# EAGLE design dda (EAGLE 7.6.0)

## Sheet 1 of 6: Power
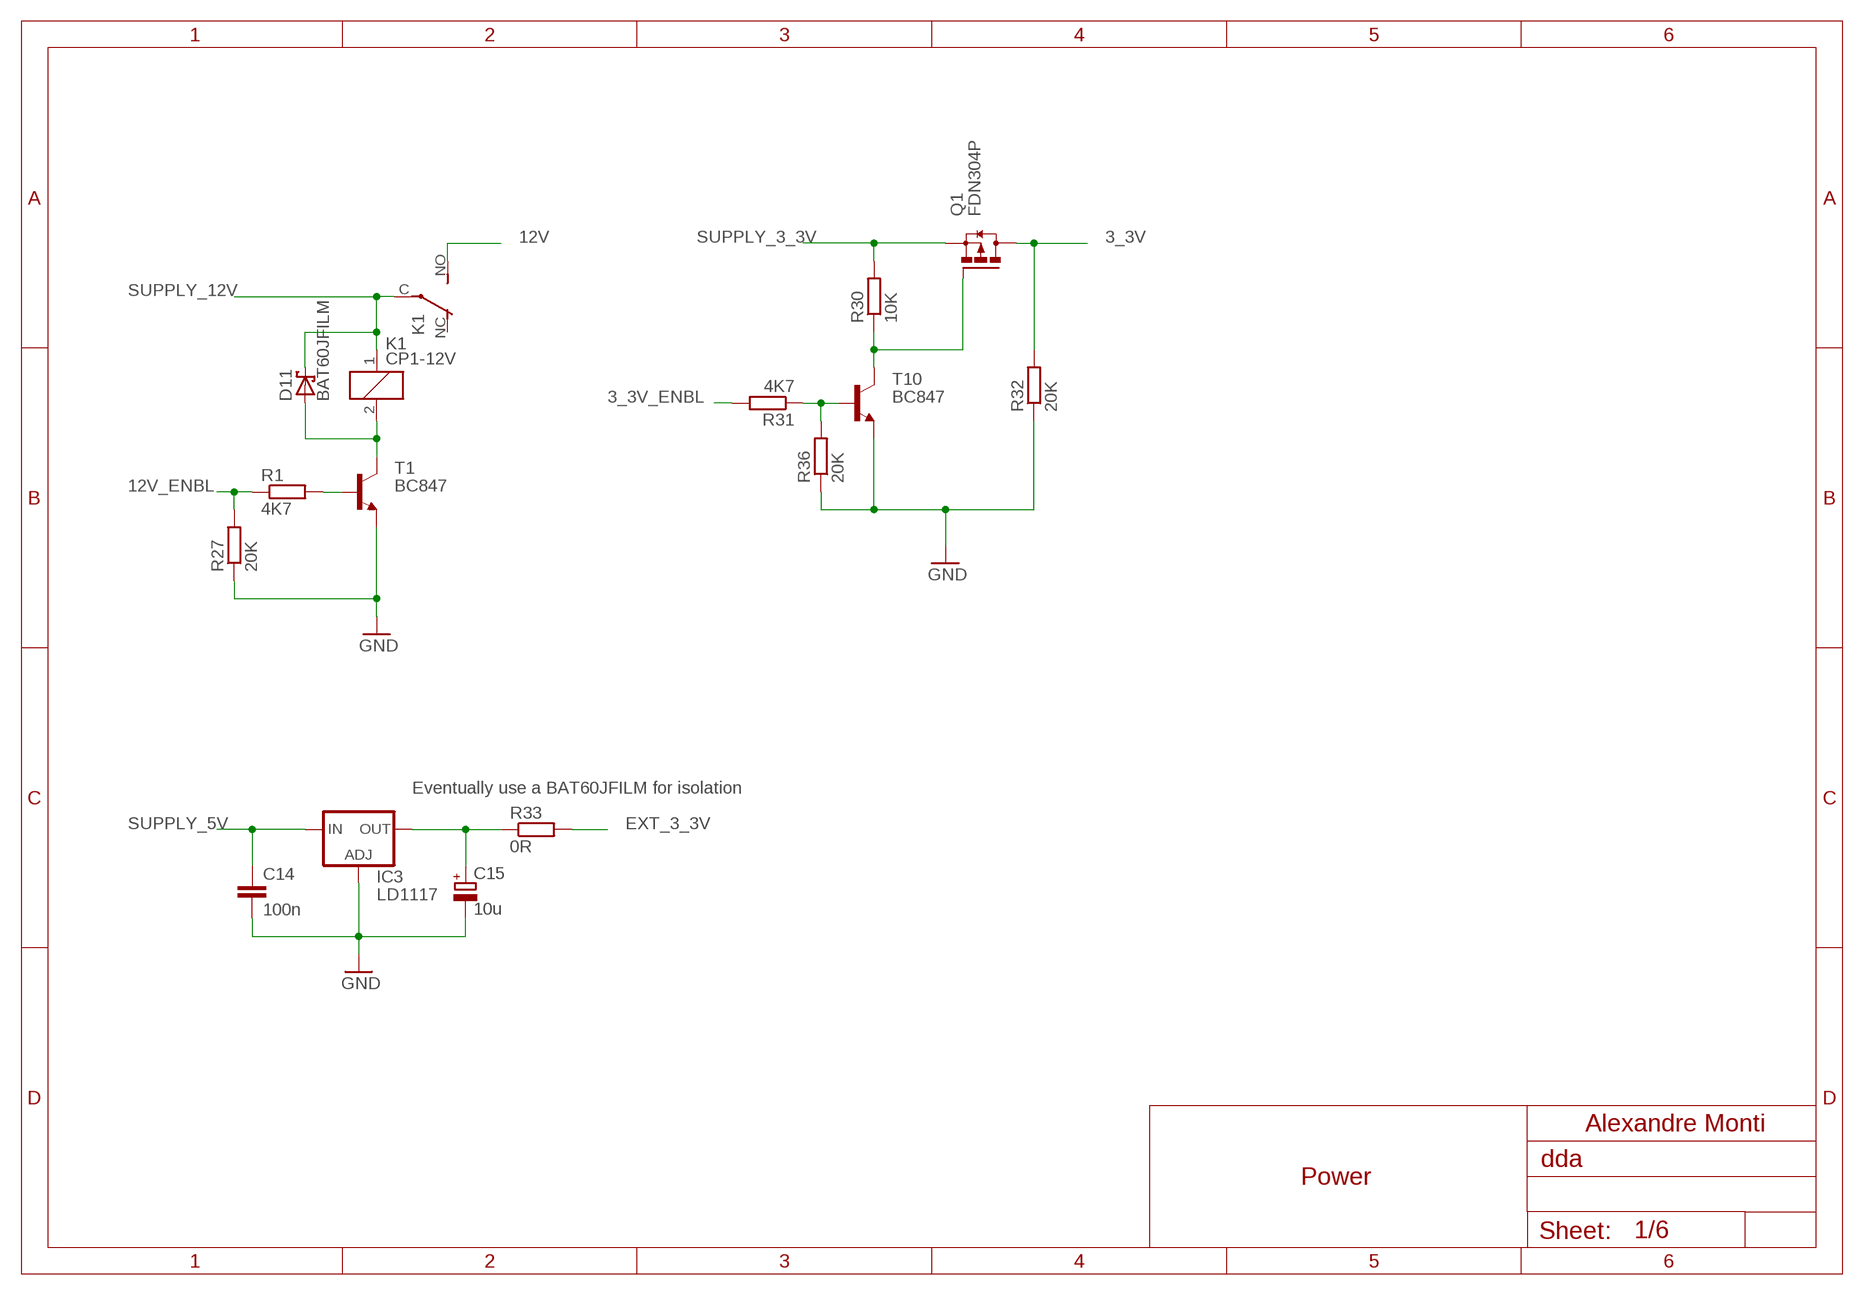
[diagram p0: schematic, sheet 1]

### Parts
C14  100n  C-EUC0805  [C0805]
C15  10u  CPOL-EUCT3216  [CT3216]
D11  BAT60JFILM  BAT60J  [SOD323_ST]
IC3  LD1117  LD117AS12TR  [SOT223]
K1  CP1-12V  [CP1]
Q1  FDN304P  FDN360P  [SUPER-SOT3]
R1  4K7  R-EU_M0805  [M0805]
R27  20K  R-EU_M0805  [M0805]
R30  10K  R-EU_M0805  [M0805]
R31  4K7  R-EU_M0805  [M0805]
R32  20K  R-EU_M0805  [M0805]
R33  0R  R-EU_R0805W  [R0805W]
R36  20K  R-EU_M0805  [M0805]
T1  BC847  [SOT23]
T10  BC847  [SOT23]

### Nets
3_3V: Q1.3(D) R32.2 ; also sheet 2,3,4,5
3_3V_ENBL: R31.2 ; also sheet 6
12V: K1.NO(2:S) ; also sheet 2,3
12V_ENBL: R1.1 R27.2 ; also sheet 5
EXT_3_3V: R33.2 ; also sheet 6
GND: C14.2 C15.- IC3.1(ADJ) R27.1 R32.1 R36.1 T1.2(E) T10.2(E) ; also sheet 2,3,4,5,6
N$1: Q1.1(G) R30.1 T10.3(C)
N$3: R31.1 R36.2 T10.1(B)
N$9: C15.+ IC3.4(OUT) R33.1
N$17: D11.A K1.2 T1.3(C)
N$18: R1.2 T1.1(B)
SUPPLY_3_3V: Q1.2(S) R30.2 ; also sheet 6
SUPPLY_5V: C14.1 IC3.3(IN) ; also sheet 6
SUPPLY_12V: D11.C K1.1 K1.C(2:P) ; also sheet 6
Unconnected: K1.NC(2:O)

### Notes on the sheet
- Eventually use a BAT60JFILM for isolation
- Alexandre Monti
- Power

## Sheet 2 of 6: LEDs
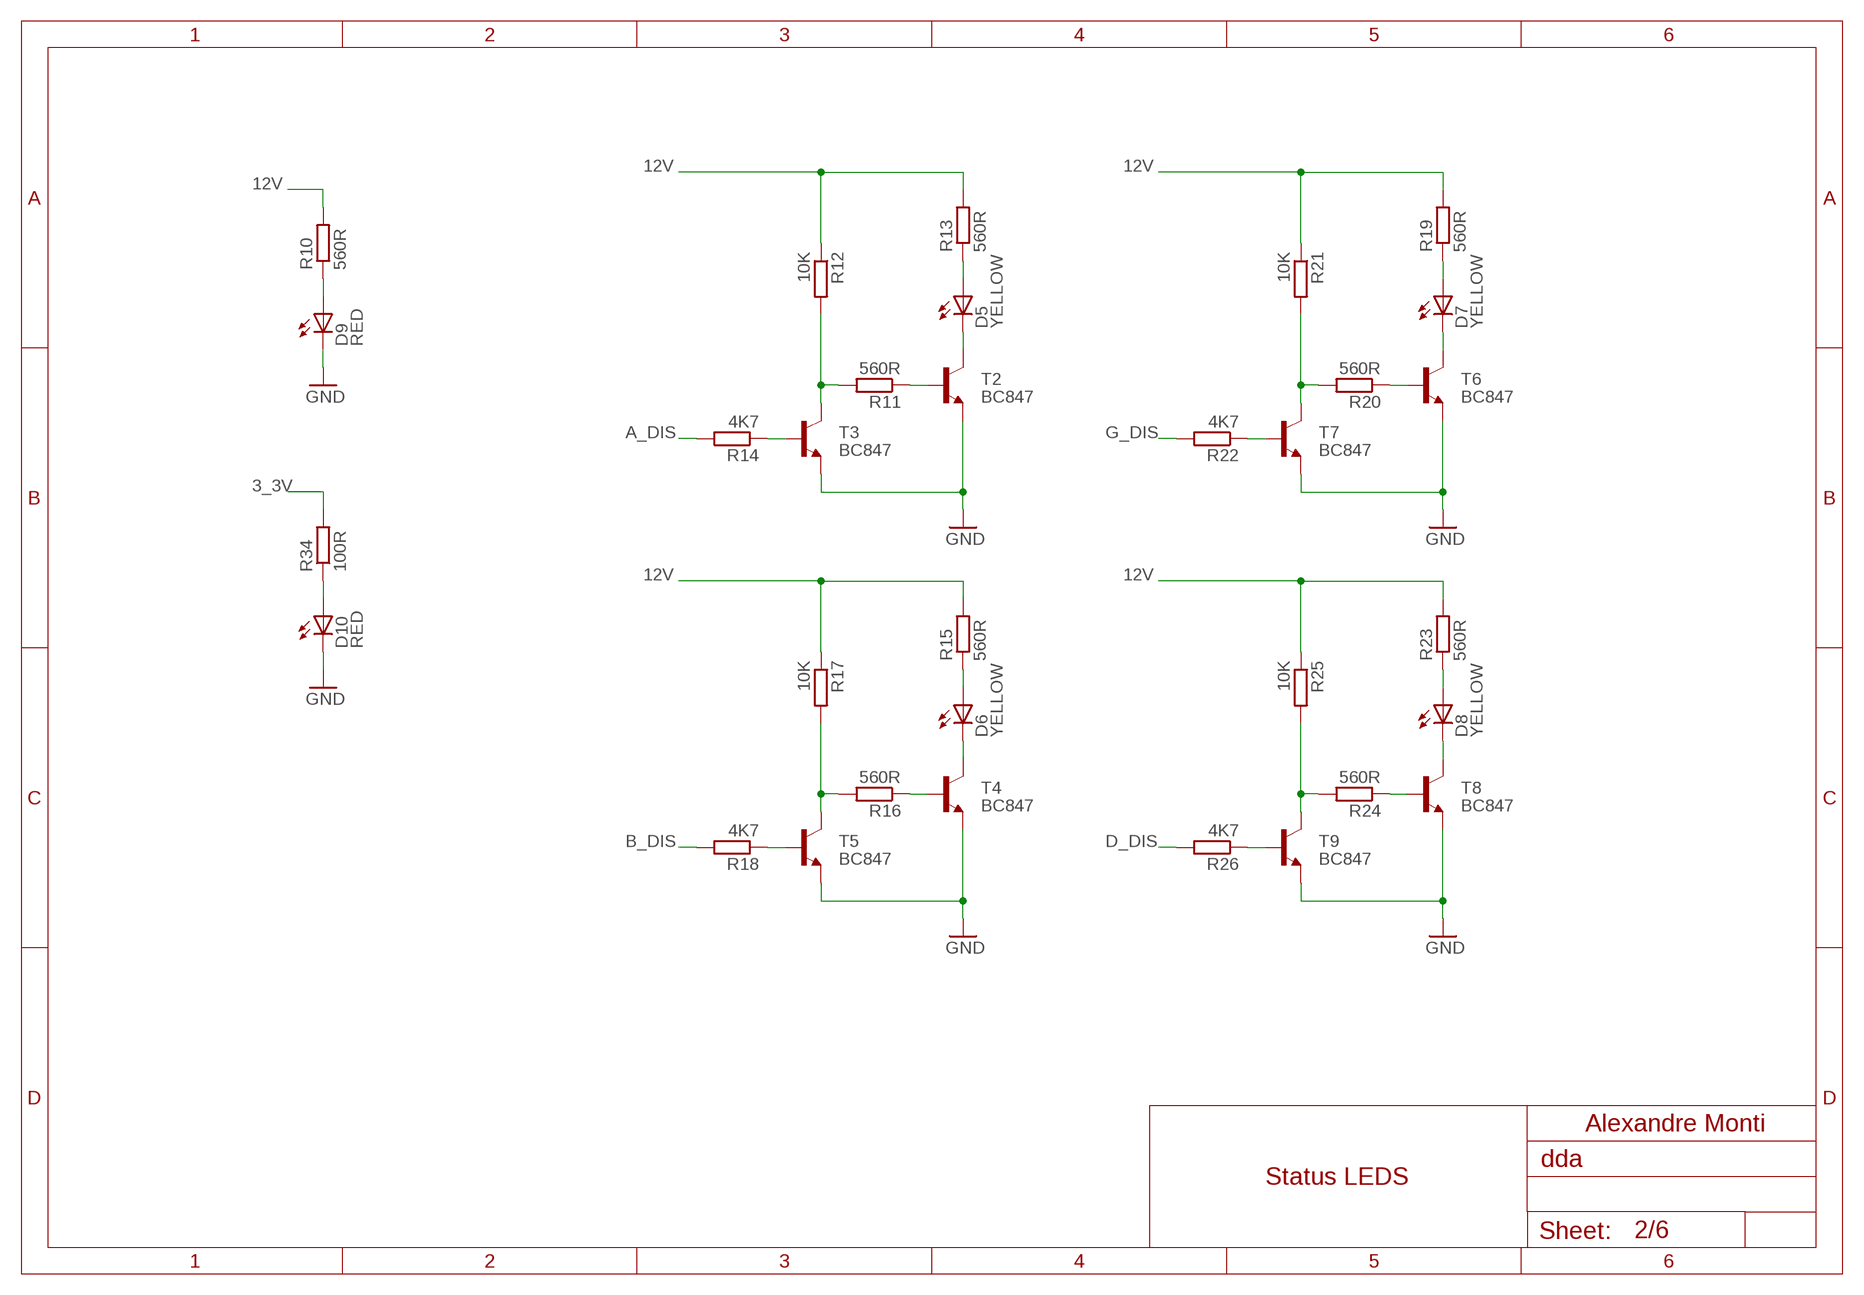
[diagram p1: schematic, sheet 2]

### Parts
D5  YELLOW  LEDCHIP-LED0805  [CHIP-LED0805]
D6  YELLOW  LEDCHIP-LED0805  [CHIP-LED0805]
D7  YELLOW  LEDCHIP-LED0805  [CHIP-LED0805]
D8  YELLOW  LEDCHIP-LED0805  [CHIP-LED0805]
D9  RED  LEDCHIP-LED0805  [CHIP-LED0805]
D10  RED  LEDCHIP-LED0805  [CHIP-LED0805]
R10  560R  R-EU_M0805  [M0805]
R11  560R  R-EU_M0805  [M0805]
R12  10K  R-EU_M0805  [M0805]
R13  560R  R-EU_M0805  [M0805]
R14  4K7  R-EU_M0805  [M0805]
R15  560R  R-EU_M0805  [M0805]
R16  560R  R-EU_M0805  [M0805]
R17  10K  R-EU_M0805  [M0805]
R18  4K7  R-EU_M0805  [M0805]
R19  560R  R-EU_M0805  [M0805]
R20  560R  R-EU_M0805  [M0805]
R21  10K  R-EU_M0805  [M0805]
R22  4K7  R-EU_M0805  [M0805]
R23  560R  R-EU_M0805  [M0805]
R24  560R  R-EU_M0805  [M0805]
R25  10K  R-EU_M0805  [M0805]
R26  4K7  R-EU_M0805  [M0805]
R34  100R  R-EU_M0805  [M0805]
T2  BC847  [SOT23]
T3  BC847  [SOT23]
T4  BC847  [SOT23]
T5  BC847  [SOT23]
T6  BC847  [SOT23]
T7  BC847  [SOT23]
T8  BC847  [SOT23]
T9  BC847  [SOT23]

### Nets
3_3V: R34.2 ; also sheet 1,3,4,5
12V: R10.2 R12.1 R13.2 R15.2 R17.1 R19.2 R21.1 R23.2 R25.1 ; also sheet 1,3
A_DIS: R14.2 ; also sheet 3,5
B_DIS: R18.2 ; also sheet 3,5
D_DIS: R26.2 ; also sheet 3,5
G_DIS: R22.2 ; also sheet 3,5
GND: D9.C D10.C T2.2(E) T3.2(E) T4.2(E) T5.2(E) T6.2(E) T7.2(E) T8.2(E) T9.2(E) ; also sheet 1,3,4,5,6
N$5: D10.A R34.1
N$28: D5.C T2.3(C)
N$29: D5.A R13.1
N$30: R11.1 T2.1(B)
N$31: R11.2 R12.2 T3.3(C)
N$32: D6.C T4.3(C)
N$33: R14.1 T3.1(B)
N$34: D6.A R15.1
N$35: R16.1 T4.1(B)
N$36: R16.2 R17.2 T5.3(C)
N$37: R18.1 T5.1(B)
N$38: D7.C T6.3(C)
N$39: D7.A R19.1
N$40: R20.1 T6.1(B)
N$41: R20.2 R21.2 T7.3(C)
N$42: R22.1 T7.1(B)
N$43: D8.C T8.3(C)
N$44: D8.A R23.1
N$45: R24.1 T8.1(B)
N$46: R24.2 R25.2 T9.3(C)
N$47: R26.1 T9.1(B)
N$885: D9.A R10.1

### Notes on the sheet
- Alexandre Monti
- Status LEDS

## Sheet 3 of 6: Steppers
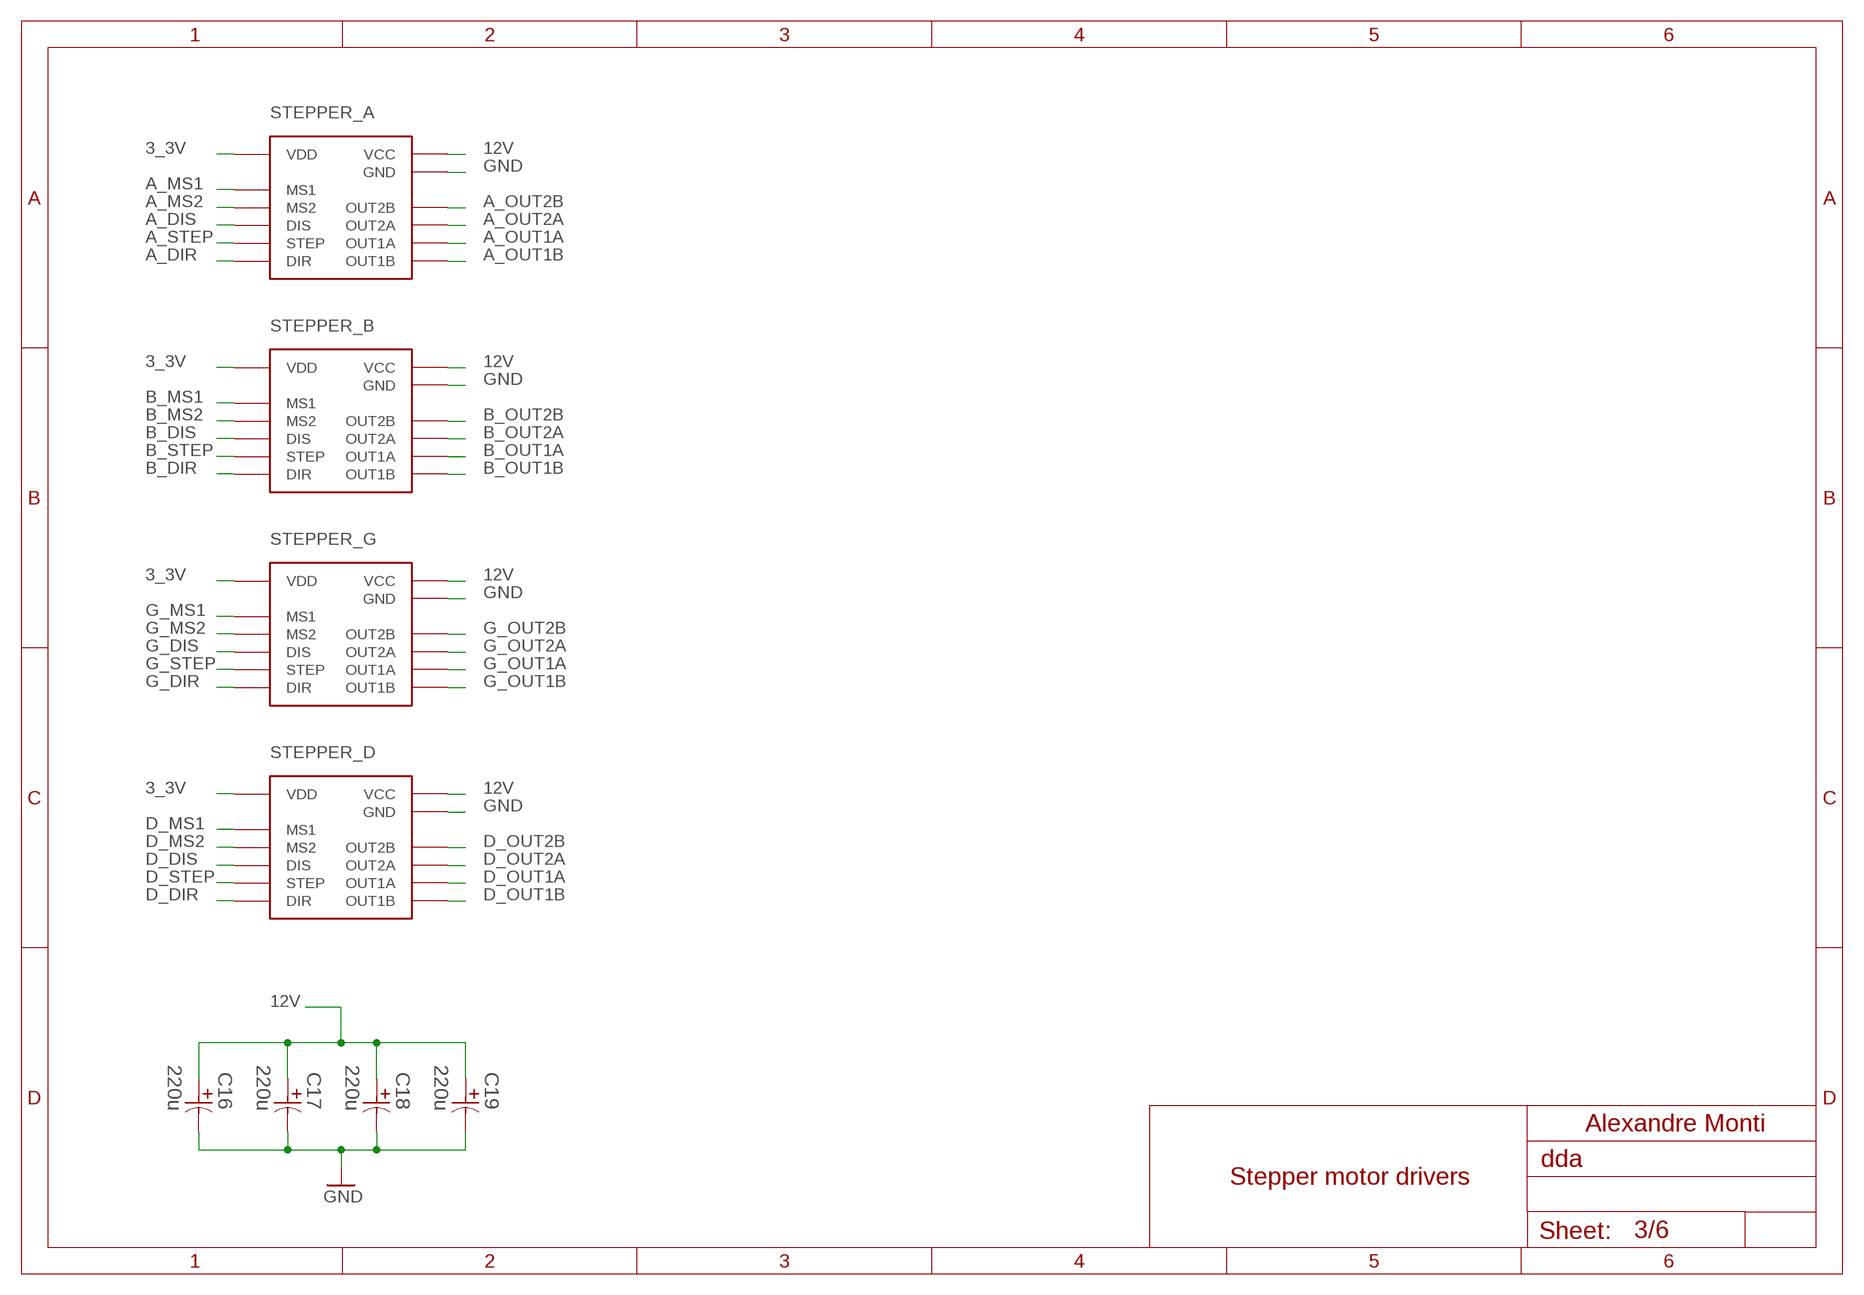
[diagram p2: schematic, sheet 3]

### Parts
C16  220u  EEE-FTE221XAP-CASE-D8  [CAPAE660X800N]
C17  220u  EEE-FTE221XAP-CASE-D8  [CAPAE660X800N]
C18  220u  EEE-FTE221XAP-CASE-D8  [CAPAE660X800N]
C19  220u  EEE-FTE221XAP-CASE-D8  [CAPAE660X800N]
STEPPER_A  REPICO_STEPPER  [REPICO_STEPPER]
STEPPER_B  REPICO_STEPPER  [REPICO_STEPPER]
STEPPER_D  REPICO_STEPPER  [REPICO_STEPPER]
STEPPER_G  REPICO_STEPPER  [REPICO_STEPPER]

### Nets
3_3V: STEPPER_A.VDD STEPPER_B.VDD STEPPER_D.VDD STEPPER_G.VDD ; also sheet 1,2,4,5
12V: C16.1 C17.1 C18.1 C19.1 STEPPER_A.VCC STEPPER_B.VCC STEPPER_D.VCC STEPPER_G.VCC ; also sheet 1,2
A_DIR: STEPPER_A.DIR ; also sheet 5
A_DIS: STEPPER_A.DIS ; also sheet 2,5
A_MS1: STEPPER_A.MS1 ; also sheet 5
A_MS2: STEPPER_A.MS2 ; also sheet 5
A_OUT1A: STEPPER_A.OUT1A ; also sheet 6
A_OUT1B: STEPPER_A.OUT1B ; also sheet 6
A_OUT2A: STEPPER_A.OUT2A ; also sheet 6
A_OUT2B: STEPPER_A.OUT2B ; also sheet 6
A_STEP: STEPPER_A.STEP ; also sheet 5
B_DIR: STEPPER_B.DIR ; also sheet 5
B_DIS: STEPPER_B.DIS ; also sheet 2,5
B_MS1: STEPPER_B.MS1 ; also sheet 5
B_MS2: STEPPER_B.MS2 ; also sheet 5
B_OUT1A: STEPPER_B.OUT1A ; also sheet 6
B_OUT1B: STEPPER_B.OUT1B ; also sheet 6
B_OUT2A: STEPPER_B.OUT2A ; also sheet 6
B_OUT2B: STEPPER_B.OUT2B ; also sheet 6
B_STEP: STEPPER_B.STEP ; also sheet 5
D_DIR: STEPPER_D.DIR ; also sheet 5
D_DIS: STEPPER_D.DIS ; also sheet 2,5
D_MS1: STEPPER_D.MS1 ; also sheet 5
D_MS2: STEPPER_D.MS2 ; also sheet 5
D_OUT1A: STEPPER_D.OUT1A ; also sheet 6
D_OUT1B: STEPPER_D.OUT1B ; also sheet 6
D_OUT2A: STEPPER_D.OUT2A ; also sheet 6
D_OUT2B: STEPPER_D.OUT2B ; also sheet 6
D_STEP: STEPPER_D.STEP ; also sheet 5
G_DIR: STEPPER_G.DIR ; also sheet 5
G_DIS: STEPPER_G.DIS ; also sheet 2,5
G_MS1: STEPPER_G.MS1 ; also sheet 5
G_MS2: STEPPER_G.MS2 ; also sheet 5
G_OUT1A: STEPPER_G.OUT1A ; also sheet 6
G_OUT1B: STEPPER_G.OUT1B ; also sheet 6
G_OUT2A: STEPPER_G.OUT2A ; also sheet 6
G_OUT2B: STEPPER_G.OUT2B ; also sheet 6
G_STEP: STEPPER_G.STEP ; also sheet 5
GND: C16.2 C17.2 C18.2 C19.2 STEPPER_A.GND STEPPER_B.GND STEPPER_D.GND STEPPER_G.GND ; also sheet 1,2,4,5,6

### Notes on the sheet
- Alexandre Monti
- Stepper motor drivers

## Sheet 4 of 6: Endstops
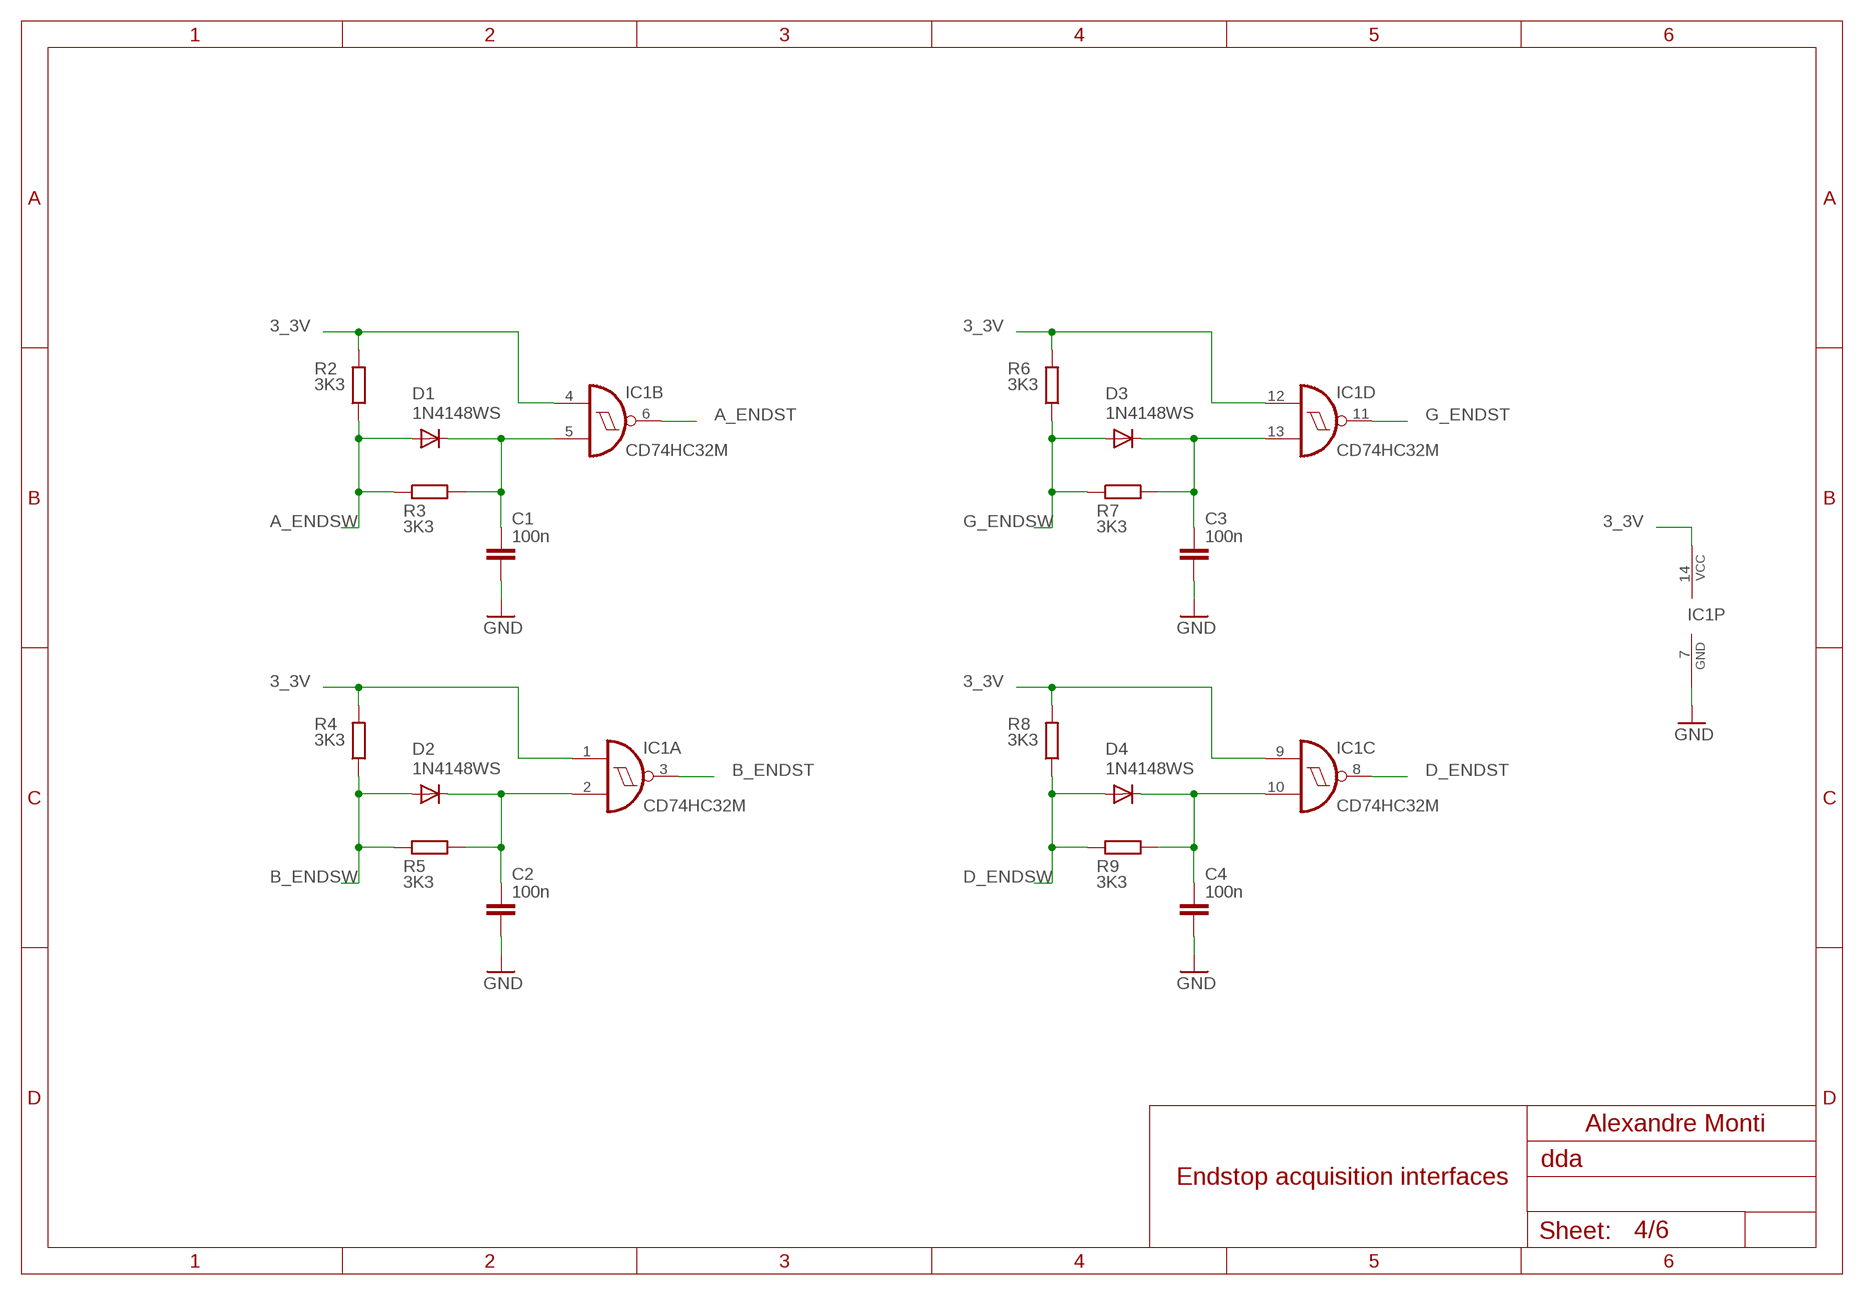
[diagram p3: schematic, sheet 4]

### Parts
C1  100n  C-EUC0805  [C0805]
C2  100n  C-EUC0805  [C0805]
C3  100n  C-EUC0805  [C0805]
C4  100n  C-EUC0805  [C0805]
D1  1N4148WS  DIODE-SOD123  [SOD123]
D2  1N4148WS  DIODE-SOD123  [SOD123]
D3  1N4148WS  DIODE-SOD123  [SOD123]
D4  1N4148WS  DIODE-SOD123  [SOD123]
IC1  CD74HC32M  74LS132D  [SO14]
R2  3K3  R-EU_M0805  [M0805]
R3  3K3  R-EU_M0805  [M0805]
R4  3K3  R-EU_M0805  [M0805]
R5  3K3  R-EU_M0805  [M0805]
R6  3K3  R-EU_M0805  [M0805]
R7  3K3  R-EU_M0805  [M0805]
R8  3K3  R-EU_M0805  [M0805]
R9  3K3  R-EU_M0805  [M0805]

### Nets
3_3V: IC1.1(A:I0) IC1.4(B:I0) IC1.9(C:I0) IC1.12(D:I0) IC1.14(P:VCC) R2.2 R4.2 R6.2 R8.2 ; also sheet 1,2,3,5
A_ENDST: IC1.6(B:O) ; also sheet 5
A_ENDSW: D1.A R2.1 R3.1 ; also sheet 6
B_ENDST: IC1.3(A:O) ; also sheet 5
B_ENDSW: D2.A R4.1 R5.1 ; also sheet 6
D_ENDST: IC1.8(C:O) ; also sheet 5
D_ENDSW: D4.A R8.1 R9.1 ; also sheet 6
G_ENDST: IC1.11(D:O) ; also sheet 5
G_ENDSW: D3.A R6.1 R7.1 ; also sheet 6
GND: C1.2 C2.2 C3.2 C4.2 IC1.7(P:GND) ; also sheet 1,2,3,5,6
N$20: C1.1 D1.C IC1.5(B:I1) R3.2
N$22: C2.1 D2.C IC1.2(A:I1) R5.2
N$24: C3.1 D3.C IC1.13(D:I1) R7.2
N$26: C4.1 D4.C IC1.10(C:I1) R9.2

### Notes on the sheet
- Alexandre Monti
- Endstop acquisition interfaces

## Sheet 5 of 6: MCU
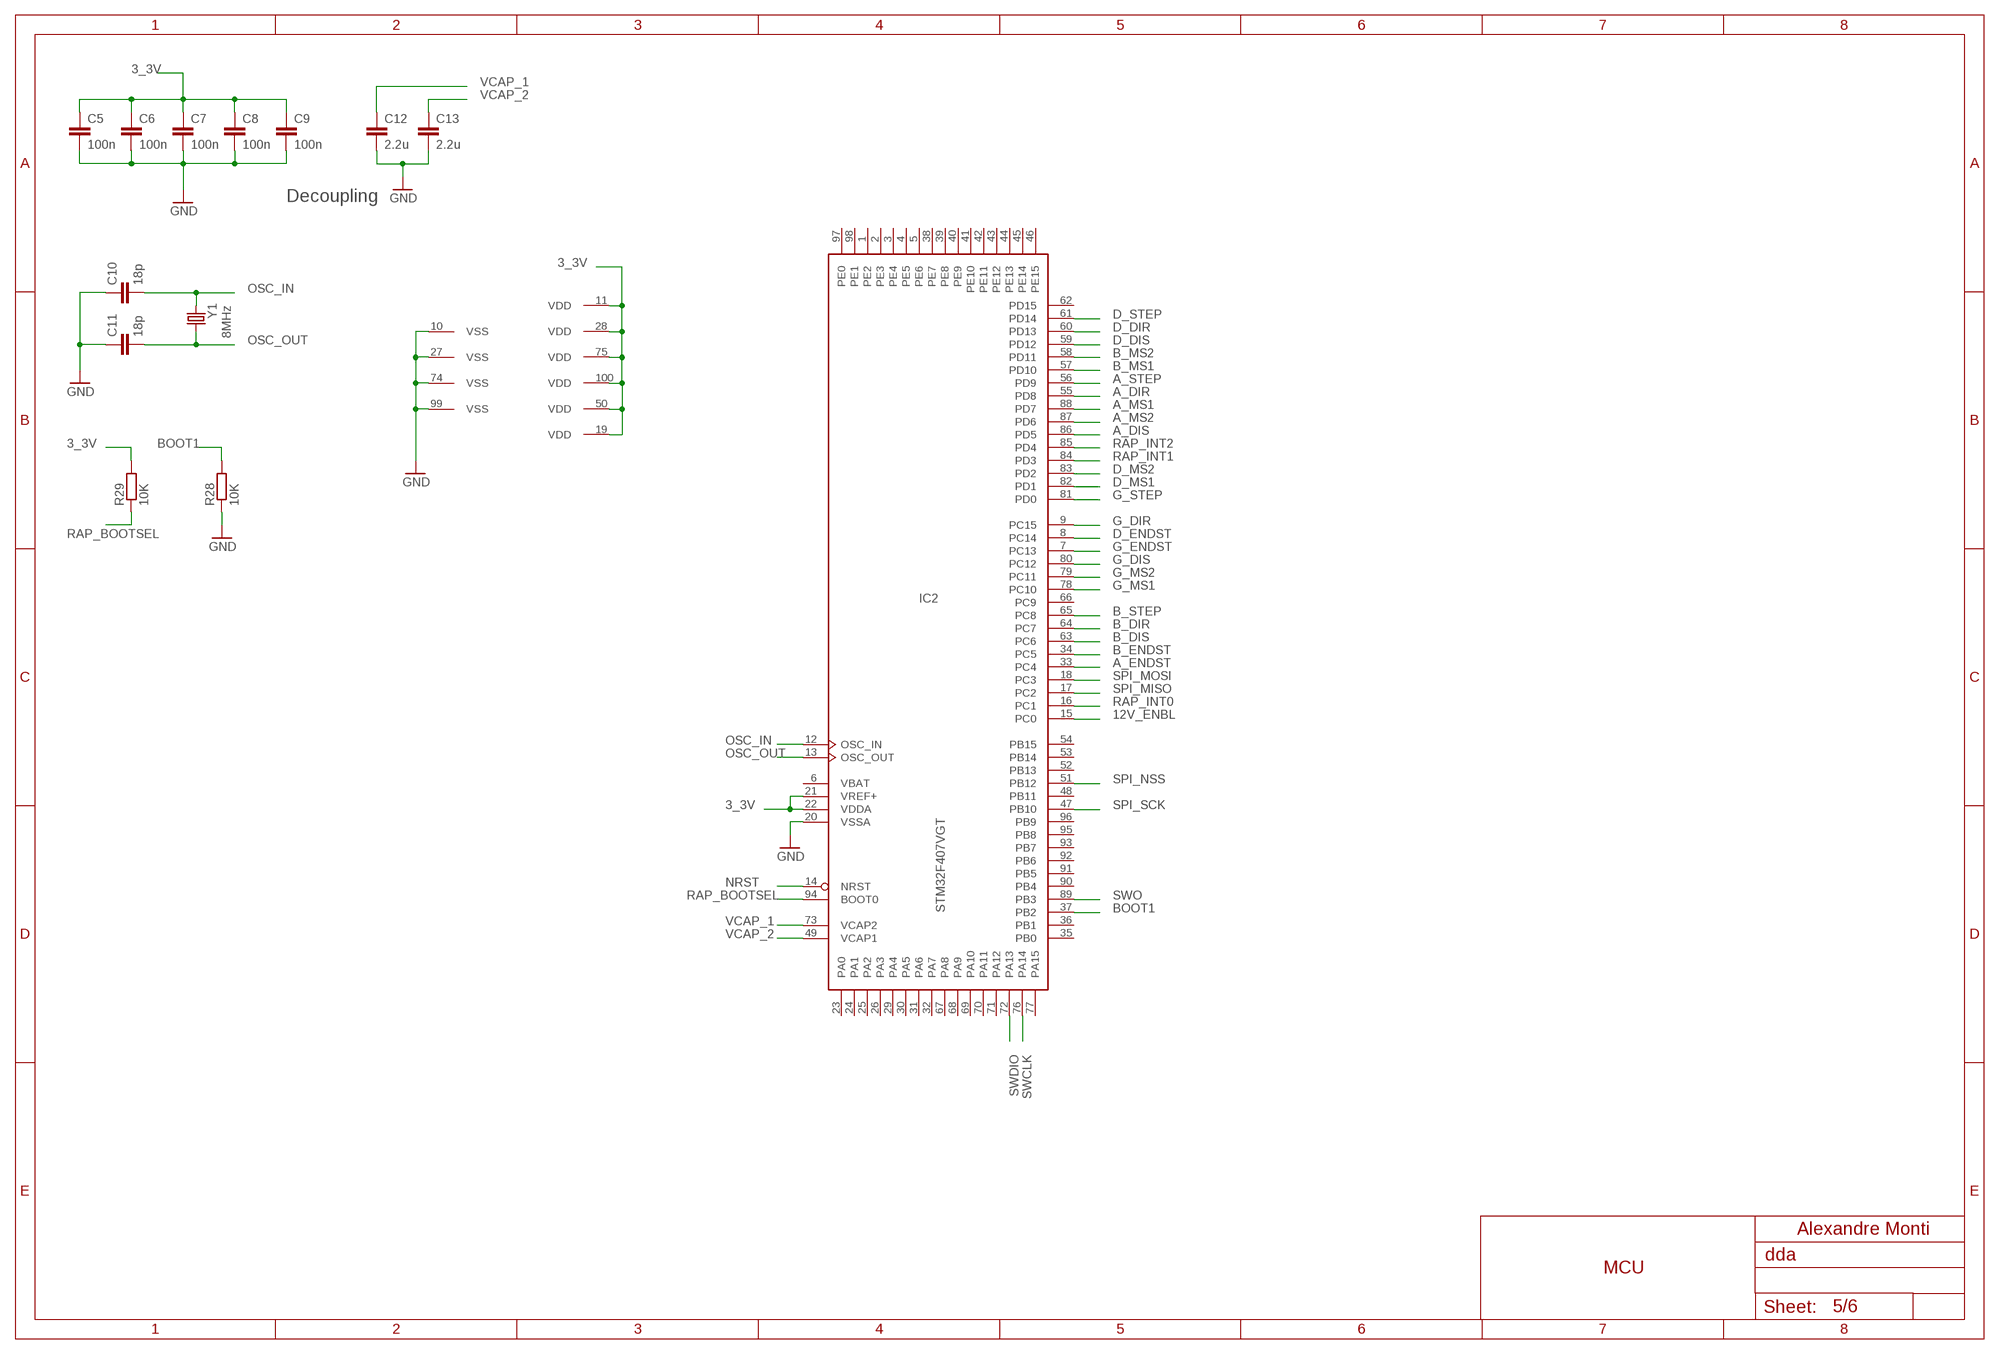
[diagram p4: schematic, sheet 5]

### Parts
C5  100n  C-EUC0805  [C0805]
C6  100n  C-EUC0805  [C0805]
C7  100n  C-EUC0805  [C0805]
C8  100n  C-EUC0805  [C0805]
C9  100n  C-EUC0805  [C0805]
C10  18p  C-EUC0805  [C0805]
C11  18p  C-EUC0805  [C0805]
C12  2.2u  C-EUC1206  [C1206]
C13  2.2u  C-EUC1206  [C1206]
IC2  STM32F407VGT  [LQFP100]
R28  10K  R-EU_M0805  [M0805]
R29  10K  R-EU_M0805  [M0805]
Y1  8MHz  CRYSTAL5X3.2  [CRYSTAL-SMD-5X3.2]

### Nets
3_3V: C5.1 C6.1 C7.1 C8.1 C9.1 IC2.11(VDD) IC2.19(VDD) IC2.21(VREF+) IC2.22(VDDA) IC2.28(VDD) IC2.50(VDD) IC2.75(VDD) IC2.100(VDD) R29.2 ; also sheet 1,2,3,4
12V_ENBL: IC2.15(PC0) ; also sheet 1
A_DIR: IC2.55(PD8) ; also sheet 3
A_DIS: IC2.86(PD5) ; also sheet 2,3
A_ENDST: IC2.33(PC4) ; also sheet 4
A_MS1: IC2.88(PD7) ; also sheet 3
A_MS2: IC2.87(PD6) ; also sheet 3
A_STEP: IC2.56(PD9) ; also sheet 3
B_DIR: IC2.64(PC7) ; also sheet 3
B_DIS: IC2.63(PC6) ; also sheet 2,3
B_ENDST: IC2.34(PC5) ; also sheet 4
B_MS1: IC2.57(PD10) ; also sheet 3
B_MS2: IC2.58(PD11) ; also sheet 3
B_STEP: IC2.65(PC8) ; also sheet 3
BOOT1: IC2.37(PB2) R28.2
D_DIR: IC2.60(PD13) ; also sheet 3
D_DIS: IC2.59(PD12) ; also sheet 2,3
D_ENDST: IC2.8(PC14) ; also sheet 4
D_MS1: IC2.82(PD1) ; also sheet 3
D_MS2: IC2.83(PD2) ; also sheet 3
D_STEP: IC2.61(PD14) ; also sheet 3
G_DIR: IC2.9(PC15) ; also sheet 3
G_DIS: IC2.80(PC12) ; also sheet 2,3
G_ENDST: IC2.7(PC13) ; also sheet 4
G_MS1: IC2.78(PC10) ; also sheet 3
G_MS2: IC2.79(PC11) ; also sheet 3
G_STEP: IC2.81(PD0) ; also sheet 3
GND: C5.2 C6.2 C7.2 C8.2 C9.2 C10.1 C11.1 C12.2 C13.2 IC2.10(VSS) IC2.20(VSSA) IC2.27(VSS) IC2.74(VSS) IC2.99(VSS) R28.1 ; also sheet 1,2,3,4,6
NRST: IC2.14(NRST) ; also sheet 6
OSC_IN: C10.2 IC2.12(OSC_IN) Y1.P$2
OSC_OUT: C11.2 IC2.13(OSC_OUT) Y1.P$1
RAP_BOOTSEL: IC2.94(BOOT0) R29.1 ; also sheet 6
RAP_INT0: IC2.16(PC1) ; also sheet 6
RAP_INT1: IC2.84(PD3) ; also sheet 6
RAP_INT2: IC2.85(PD4) ; also sheet 6
SPI_MISO: IC2.17(PC2) ; also sheet 6
SPI_MOSI: IC2.18(PC3) ; also sheet 6
SPI_NSS: IC2.51(PB12) ; also sheet 6
SPI_SCK: IC2.47(PB10) ; also sheet 6
SWCLK: IC2.76(PA14) ; also sheet 6
SWDIO: IC2.72(PA13) ; also sheet 6
SWO: IC2.89(PB3) ; also sheet 6
VCAP_1: C12.1 IC2.73(VCAP2)
VCAP_2: C13.1 IC2.49(VCAP1)
Unconnected: IC2.1(PE2) IC2.2(PE3) IC2.3(PE4) IC2.4(PE5) IC2.5(PE6) IC2.23(PA0) IC2.24(PA1) IC2.25(PA2) IC2.26(PA3) IC2.29(PA4) IC2.30(PA5) IC2.31(PA6) IC2.32(PA7) IC2.35(PB0) IC2.36(PB1) IC2.38(PE7) IC2.39(PE8) IC2.40(PE9) IC2.41(PE10) IC2.42(PE11) IC2.43(PE12) IC2.44(PE13) IC2.45(PE14) IC2.46(PE15) IC2.48(PB11) IC2.52(PB13) IC2.53(PB14) IC2.54(PB15) IC2.62(PD15) IC2.66(PC9) IC2.67(PA8) IC2.68(PA9) IC2.69(PA10) IC2.70(PA11) IC2.71(PA12) IC2.77(PA15) IC2.90(PB4) IC2.91(PB5) IC2.92(PB6) IC2.93(PB7) IC2.95(PB8) IC2.96(PB9) IC2.97(PE0) IC2.98(PE1)

### Notes on the sheet
- Decoupling
- Alexandre Monti
- MCU

## Sheet 6 of 6: Connectors
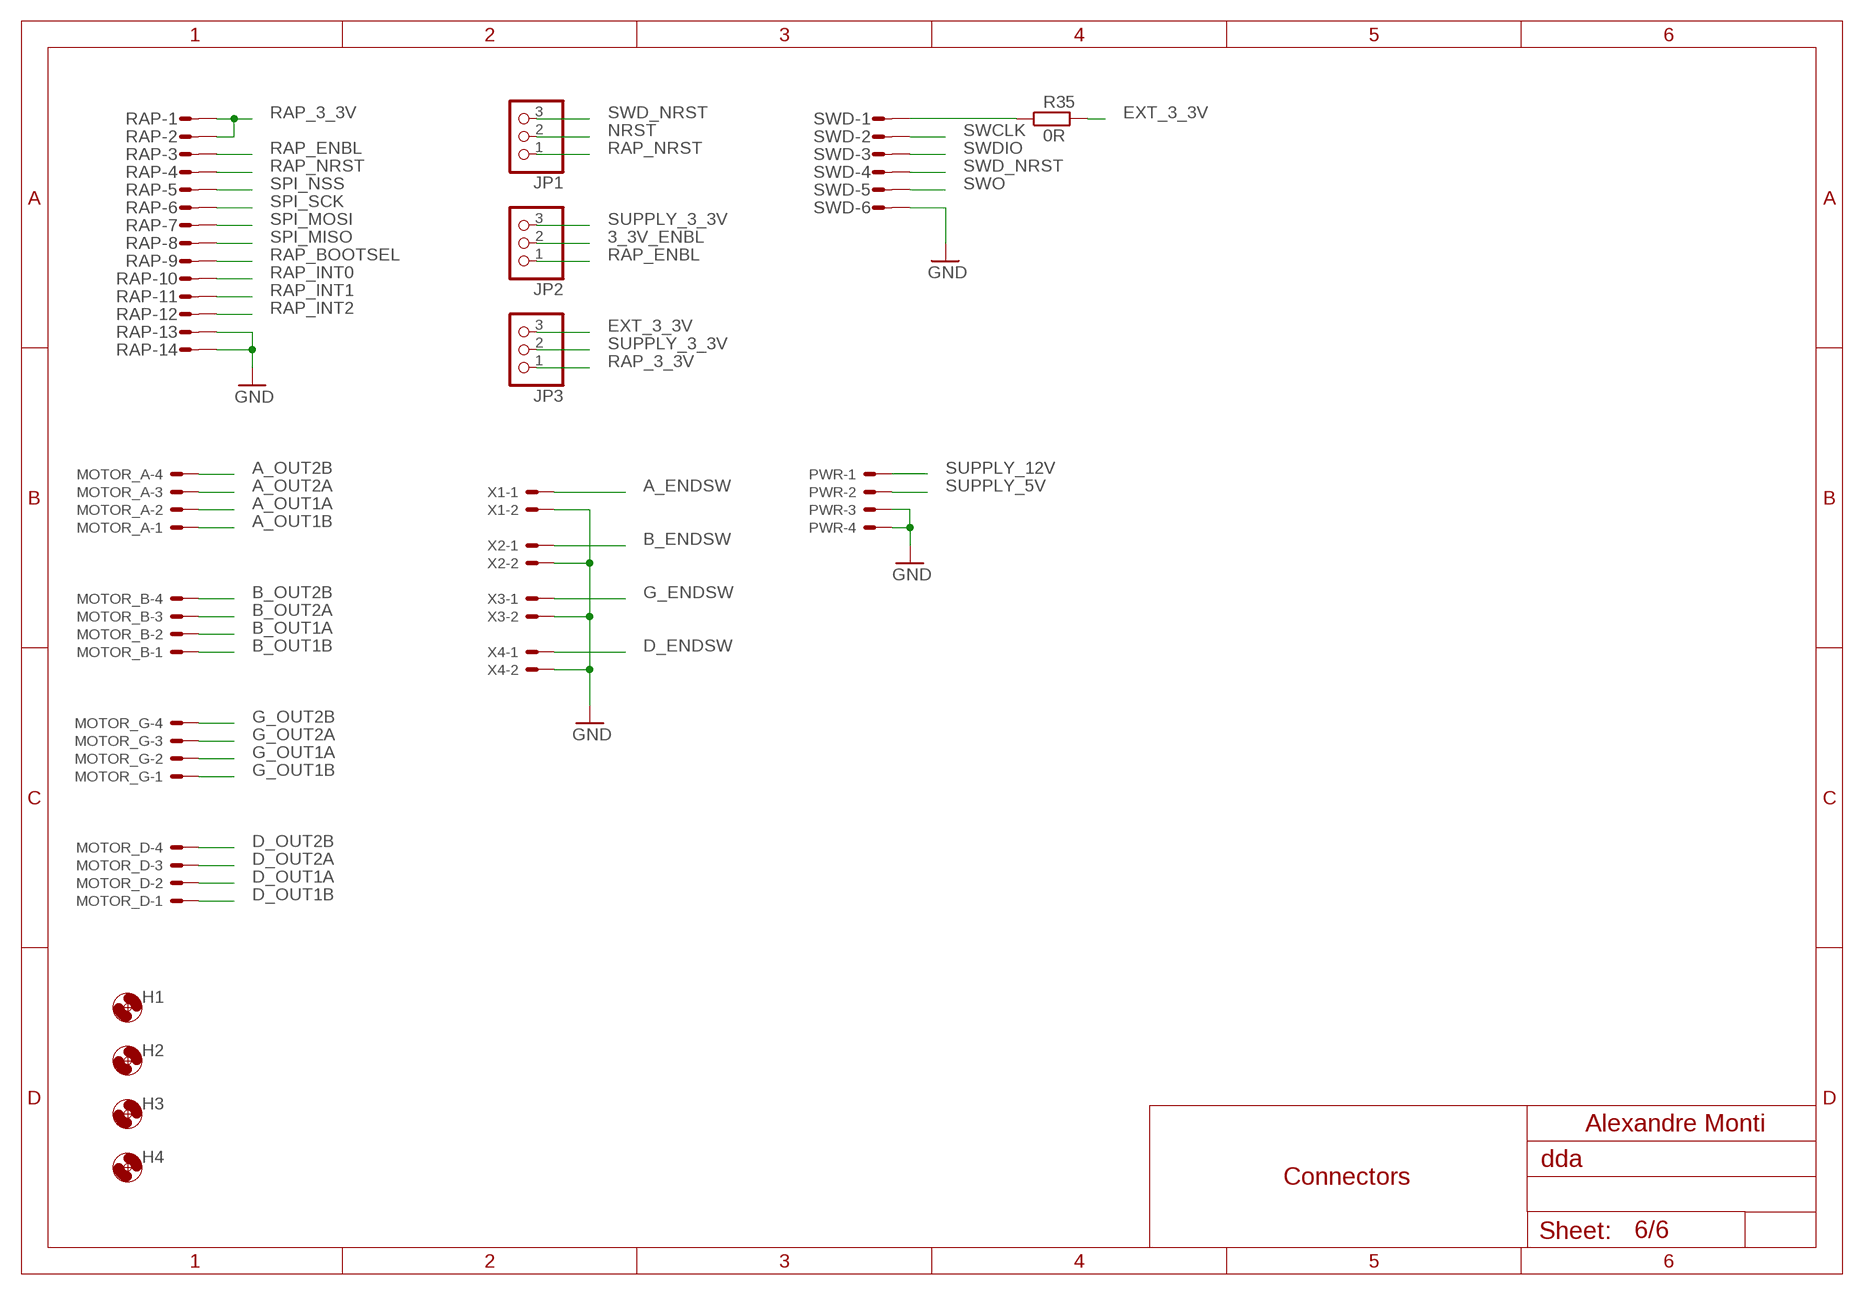
[diagram p5: schematic, sheet 6]

### Parts
H1  MOUNT-HOLE3.2  [3,2]
H2  MOUNT-HOLE3.2  [3,2]
H3  MOUNT-HOLE3.2  [3,2]
H4  MOUNT-HOLE3.2  [3,2]
JP1  PINHD-1X03_2.00  [1X03M]
JP2  PINHD-1X03_2.00  [1X03M]
JP3  PINHD-1X03_2.00  [1X03M]
MOTOR_A  22-23-2041  [22-23-2041]
MOTOR_B  22-23-2041  [22-23-2041]
MOTOR_D  22-23-2041  [22-23-2041]
MOTOR_G  22-23-2041  [22-23-2041]
PWR  22-23-2041  [22-23-2041]
R35  0R  R-EU_R0805W  [R0805W]
RAP  MICROMATCH-14  [MICROMATCH-14]
SWD  MICROMATCH-6  [MICROMATCH-6]
X1  22-23-2021  [22-23-2021]
X2  22-23-2021  [22-23-2021]
X3  22-23-2021  [22-23-2021]
X4  22-23-2021  [22-23-2021]

### Nets
3_3V_ENBL: JP2.2 ; also sheet 1
A_ENDSW: X1.1 ; also sheet 4
A_OUT1A: MOTOR_A.2 ; also sheet 3
A_OUT1B: MOTOR_A.1 ; also sheet 3
A_OUT2A: MOTOR_A.3 ; also sheet 3
A_OUT2B: MOTOR_A.4 ; also sheet 3
B_ENDSW: X2.1 ; also sheet 4
B_OUT1A: MOTOR_B.2 ; also sheet 3
B_OUT1B: MOTOR_B.1 ; also sheet 3
B_OUT2A: MOTOR_B.3 ; also sheet 3
B_OUT2B: MOTOR_B.4 ; also sheet 3
D_ENDSW: X4.1 ; also sheet 4
D_OUT1A: MOTOR_D.2 ; also sheet 3
D_OUT1B: MOTOR_D.1 ; also sheet 3
D_OUT2A: MOTOR_D.3 ; also sheet 3
D_OUT2B: MOTOR_D.4 ; also sheet 3
EXT_3_3V: JP3.3 R35.2 ; also sheet 1
G_ENDSW: X3.1 ; also sheet 4
G_OUT1A: MOTOR_G.2 ; also sheet 3
G_OUT1B: MOTOR_G.1 ; also sheet 3
G_OUT2A: MOTOR_G.3 ; also sheet 3
G_OUT2B: MOTOR_G.4 ; also sheet 3
GND: PWR.3 PWR.4 RAP.13 RAP.14 SWD.6 X1.2 X2.2 X3.2 X4.2 ; also sheet 1,2,3,4,5
N$2: R35.1 SWD.1
NRST: JP1.2 ; also sheet 5
RAP_3_3V: JP3.1 RAP.1 RAP.2
RAP_BOOTSEL: RAP.9 ; also sheet 5
RAP_ENBL: JP2.1 RAP.3
RAP_INT0: RAP.10 ; also sheet 5
RAP_INT1: RAP.11 ; also sheet 5
RAP_INT2: RAP.12 ; also sheet 5
RAP_NRST: JP1.1 RAP.4
SPI_MISO: RAP.8 ; also sheet 5
SPI_MOSI: RAP.7 ; also sheet 5
SPI_NSS: RAP.5 ; also sheet 5
SPI_SCK: RAP.6 ; also sheet 5
SUPPLY_3_3V: JP2.3 JP3.2 ; also sheet 1
SUPPLY_5V: PWR.2 ; also sheet 1
SUPPLY_12V: PWR.1 ; also sheet 1
SWCLK: SWD.2 ; also sheet 5
SWD_NRST: JP1.3 SWD.4
SWDIO: SWD.3 ; also sheet 5
SWO: SWD.5 ; also sheet 5

### Notes on the sheet
- Alexandre Monti
- Connectors

## Power pins joined to a net without a drawn wire
VBAT: IC2.6(VBAT)

## Library data of the parts
C1-C9 C14 = rcl:C-EU: CAPACITOR, European symbol; PARTNO: 2496944
C10 C11 = rcl:C-EU: CAPACITOR, European symbol; PARTNO: 1414673
C12 C13 = rcl:C-EU: CAPACITOR, European symbol; PARTNO: 1759477
C15 = rcl:CPOL-EU: POLARIZED CAPACITOR, European symbol; PARTNO: 1432339
C16-C19 = Panasonic-EEEFT_EEEH:EEE-: Aluminum Electrolytic Capacitors,Surface Mount Type; MPN: EEE-FTE221XAP; OC_FARNELL: 1868409; OC_NEWARK: 31T8170; PACKAGE: CASE-D8; PARTNO: 1868409; SUPPLIER: PANASONIC; TOLERANCE: ±20 %; VALUE: 220UF; VOLTAGERATING: 25V
D1-D4 = diode:DIODE-: DIODE; PARTNO: 1466524
D5-D8 = led:LED: LED OSRAM: - CHIPLED LG R971, LG N971, LY N971, LG Q971, LY Q971, LO R971, LY R971 LH N974, LH R974 LS Q976, LO Q976, LY Q976 LO Q996 - Hyper CHIPLED LW Q18S LB Q993, LB Q99A, LB R99A - SideLED LS A670, LO A670, LY A670, LG A670, LP A670 LB A673, LV A673, LT A673, LW A673 LH A674 LY A675 LS A676, LA A676, LO A676, LY A676, LW A676 LS A679, LY A679, LG A679 - Hyper Micro SIDELED® LS Y876, LA Y876, LO Y876, LY Y876 LT Y87S - SmartLED LW L88C, LW L88S LB L89C, LB L89S, LG L890 LS L89K, LO L89K, LY L89K LS L896, LA L896, LO L896, LY L896 - TOPLED LS T670, LO T670, LY T670, LG T670, LP T670 LSG T670, LSP T670, LSY T670, LOP T670, LYG T670 LG T671, LOG T671, LSG T671 LB T673, LV T673, LT T673, LW T673 LH T674 LS T676, LA T676, LO T676, LY T676, LB T676, LH T676, LSB T676, LW T676 LB T67C, LV T67C, LT T67C, LS T67K, LO T67K, LY T67K, LW E67C LS E67B, LA E67B, LO E67B, LY E67B, LB E67C, LV E67C, LT E67C LW T67C LS T679, LY T679, LG T679 LS T770, LO T770, LY T770, LG T770, LP T770 LB T773, LV T773, LT T773, LW T773 LH T774 LS E675, LA E675, LY E675, LS T675 LS T776, LA T776, LO T776, LY T776, LB T776 LHGB T686 LT T68C, LB T68C - Hyper Mini TOPLED® LB M676 - Mini TOPLED Santana® LG M470 LS M47K, LO M47K, LY M47K Source: http://www.osram.convergy.de LUXEON: - LUMILED® LXK2-PW12-R00, LXK2-PW12-S00, LXK2-PW14-U00, LXK2-PW14-V00 LXK2-PM12-R00, LXK2-PM12-S00, LXK2-PM14-U00 LXK2-PE12-Q00, LXK2-PE12-R00, LXK2-PE12-S00, LXK2-PE14-T00, LXK2-PE14-U00 LXK2-PB12-K00, LXK2-PB12-L00, LXK2-PB12-M00, LXK2-PB14-N00, LXK2-PB14-P00, LXK2-PB14-Q00 LXK2-PR12-L00, LXK2-PR12-M00, LXK2-PR14-Q00, LXK2-PR14-R00 LXK2-PD12-Q00, LXK2-PD12-R00, LXK2-PD12-S00 LXK2-PH12-R00, LXK2-PH12-S00 LXK2-PL12-P00, LXK2-PL12-Q00, LXK2-PL12-R00 Source: www.luxeon.com KINGBRIGHT: KA-3528ASYC Source: www.kingbright.com; PARTNO: 1581241
D9 D10 = led:LED: LED OSRAM: - CHIPLED LG R971, LG N971, LY N971, LG Q971, LY Q971, LO R971, LY R971 LH N974, LH R974 LS Q976, LO Q976, LY Q976 LO Q996 - Hyper CHIPLED LW Q18S LB Q993, LB Q99A, LB R99A - SideLED LS A670, LO A670, LY A670, LG A670, LP A670 LB A673, LV A673, LT A673, LW A673 LH A674 LY A675 LS A676, LA A676, LO A676, LY A676, LW A676 LS A679, LY A679, LG A679 - Hyper Micro SIDELED® LS Y876, LA Y876, LO Y876, LY Y876 LT Y87S - SmartLED LW L88C, LW L88S LB L89C, LB L89S, LG L890 LS L89K, LO L89K, LY L89K LS L896, LA L896, LO L896, LY L896 - TOPLED LS T670, LO T670, LY T670, LG T670, LP T670 LSG T670, LSP T670, LSY T670, LOP T670, LYG T670 LG T671, LOG T671, LSG T671 LB T673, LV T673, LT T673, LW T673 LH T674 LS T676, LA T676, LO T676, LY T676, LB T676, LH T676, LSB T676, LW T676 LB T67C, LV T67C, LT T67C, LS T67K, LO T67K, LY T67K, LW E67C LS E67B, LA E67B, LO E67B, LY E67B, LB E67C, LV E67C, LT E67C LW T67C LS T679, LY T679, LG T679 LS T770, LO T770, LY T770, LG T770, LP T770 LB T773, LV T773, LT T773, LW T773 LH T774 LS E675, LA E675, LY E675, LS T675 LS T776, LA T776, LO T776, LY T776, LB T776 LHGB T686 LT T68C, LB T68C - Hyper Mini TOPLED® LB M676 - Mini TOPLED Santana® LG M470 LS M47K, LO M47K, LY M47K Source: http://www.osram.convergy.de LUXEON: - LUMILED® LXK2-PW12-R00, LXK2-PW12-S00, LXK2-PW14-U00, LXK2-PW14-V00 LXK2-PM12-R00, LXK2-PM12-S00, LXK2-PM14-U00 LXK2-PE12-Q00, LXK2-PE12-R00, LXK2-PE12-S00, LXK2-PE14-T00, LXK2-PE14-U00 LXK2-PB12-K00, LXK2-PB12-L00, LXK2-PB12-M00, LXK2-PB14-N00, LXK2-PB14-P00, LXK2-PB14-Q00 LXK2-PR12-L00, LXK2-PR12-M00, LXK2-PR14-Q00, LXK2-PR14-R00 LXK2-PD12-Q00, LXK2-PD12-R00, LXK2-PD12-S00 LXK2-PH12-R00, LXK2-PH12-S00 LXK2-PL12-P00, LXK2-PL12-Q00, LXK2-PL12-R00 Source: www.luxeon.com KINGBRIGHT: KA-3528ASYC Source: www.kingbright.com; PARTNO: 1581239
D11 = diode:BAT60J: Schottky barrier diode Source: www.st.com, BAT60J.pdf; PARTNO: 1467544
H1-H4 = holes:MOUNT-HOLE: MOUNTING HOLE with drill center marker; BOM: EXCLUDE
IC1 = 74xx-us:74*132: Quad 2-input NAND schmitt trigger; PARTNO: 1103158
IC2 = micro-stm_v2:STM32F407V*T: ARM 32-bit Cortex™-M3 CPU 168 MHz maximum frequency 512 to 1024 Kbytes of Flash memory 192 kbytes of SRAM 82 GPIOs 1.8 to 3.6 V application supply; PARTNO: 2064368
IC3 = v-reg:LD117A?*: Low drop fixed and adjustable positive voltage regulators 1 A Source: http://www.st.com/stonline/products/literature/ds/7194/ld1117axx.pdf; PARTNO: 1202826
JP1-JP3 = pinhead-2:PINHD-1X03: PIN HEADER; PARTNO: 2289777
K1 = relay:CP1?-*: ULTRA-MINIATURE LOW PROFILE AUTOMOTIVE RELAY NAiS Source: http://www.mew-europe.com/.. en_ds_61207_0000.pdf; MF: AROMAT/ MATSUSHITA; MPN: CP1-12V; OC_FARNELL: unknown; OC_NEWARK: 10C5508; PARTNO: 2103582
MOTOR_A MOTOR_B MOTOR_D MOTOR_G PWR = con-molex:22-23-2041: .100" (2.54mm) Center Header - 4 Pin; MF: MOLEX; MPN: 22-23-2041; OC_FARNELL: 1462920; OC_NEWARK: 38C0355; PARTNO: 588593
Q1 = transistor-power:FDN360P: Single P-Channel, PowerTrench (R) MOSFET Source: http://www.fairchildsemi.com/ds/FD/FDN360P.pdf; PARTNO: 9846298
R1 R14 R18 R22 R26 R31 = rcl:R-EU_: RESISTOR, European symbol; PARTNO: 9333266
R2-R9 = rcl:R-EU_: RESISTOR, European symbol; PARTNO: 9333045
R10 R11 R13 R15 R16 R19 R20 R23 R24 = rcl:R-EU_: RESISTOR, European symbol; PARTNO: 9334688
R12 R17 R21 R25 R28-R30 = rcl:R-EU_: RESISTOR, European symbol; PARTNO: 9332391
R27 R32 R36 = rcl:R-EU_: RESISTOR, European symbol; PARTNO: 9332774
R33 R35 = rcl:R-EU_: RESISTOR, European symbol; PARTNO: 9333681
R34 = rcl:R-EU_: RESISTOR, European symbol; PARTNO: 9237364
RAP = con-amp-micromatch:MICROMATCH-14: MicroMaTch 14 8-215464-4 / 1-215464-4 Drawing Number C-215464 DDEController.pdf; MATE_PARTNO: 149135; MF: FARNELL; MPN: 8-215464-4; OC_FARNELL: 3784678; OC_NEWARK: 19J6431; PARTNO: 2308807
STEPPER_A STEPPER_B STEPPER_D STEPPER_G = stepper_module:REPICO_STEPPER; PARTNO: 1593462
SWD = con-amp-micromatch:MICROMATCH-6: MicroMaTch 6 7-215464-6 / 0-215464-6 Drawing Number C-215464 DDEController.pdf; MATE_PARTNO: 149068; MPN: 7-215464-6; OC_FARNELL: 3784630; OC_NEWARK: 19R8125; PARTNO: 2473349
T1-T10 = transistor:BC847: NPN TRANSISTOR; PARTNO: 2432696
X1-X4 = con-molex:22-23-2021: .100" (2.54mm) Center Header - 2 Pin; MF: MOLEX; MPN: 22-23-2021; OC_FARNELL: 1462926; OC_NEWARK: 25C3832; PARTNO: 588570
Y1 = Simplex-FreqCtrl:CRYSTAL: smd crystals; PARTNO: 2101329

## Board
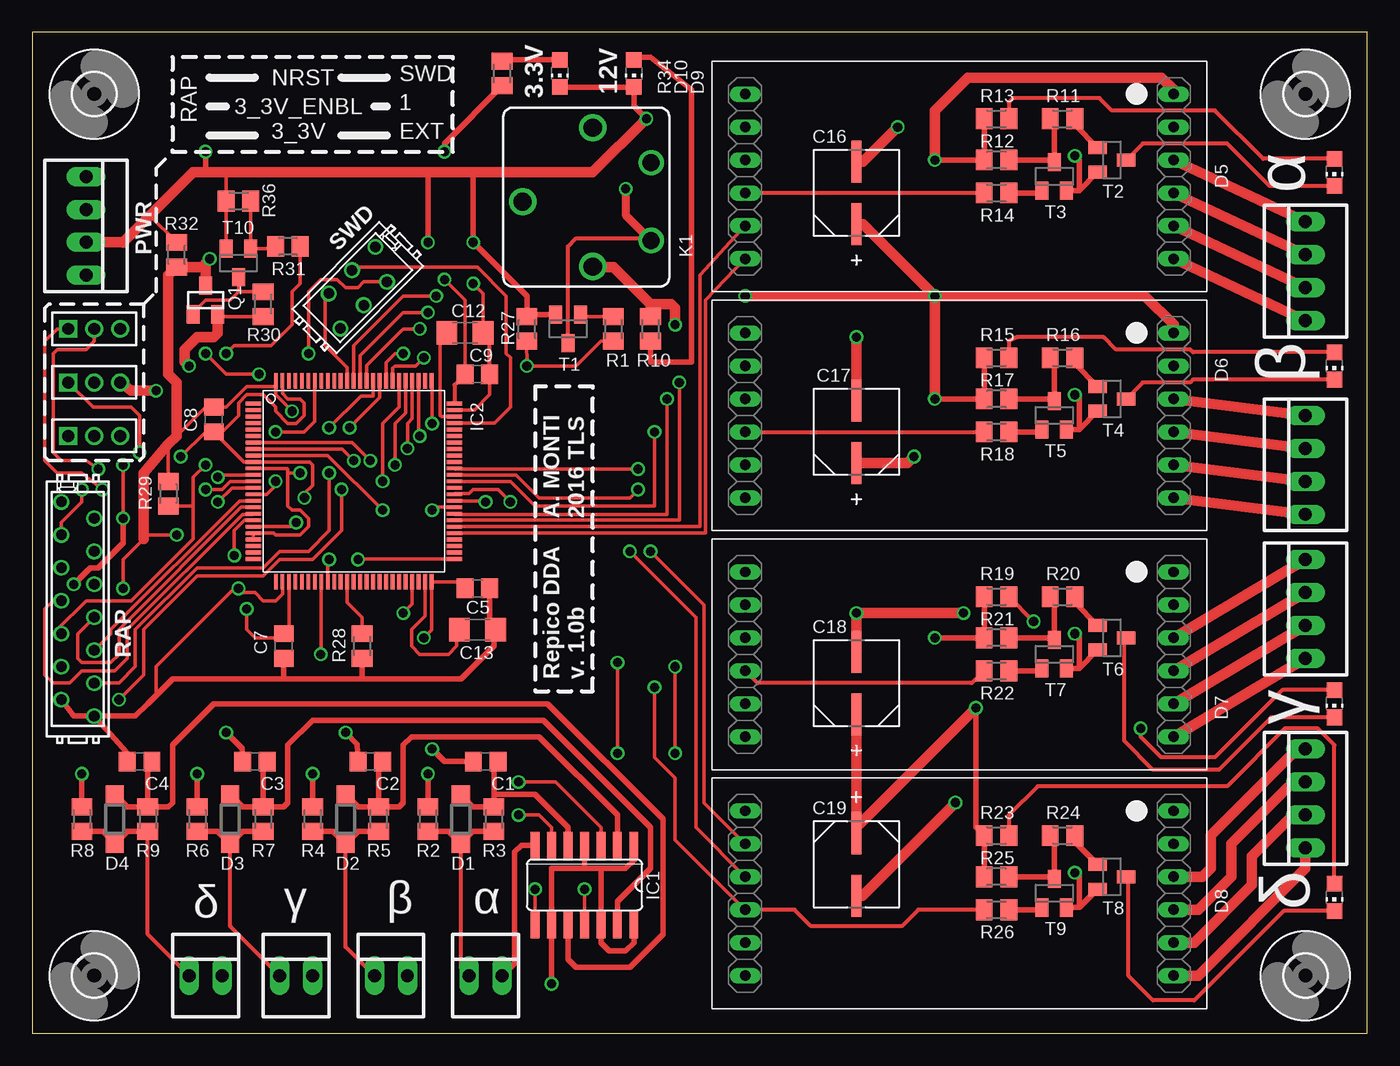
[diagram p6: board, top side]
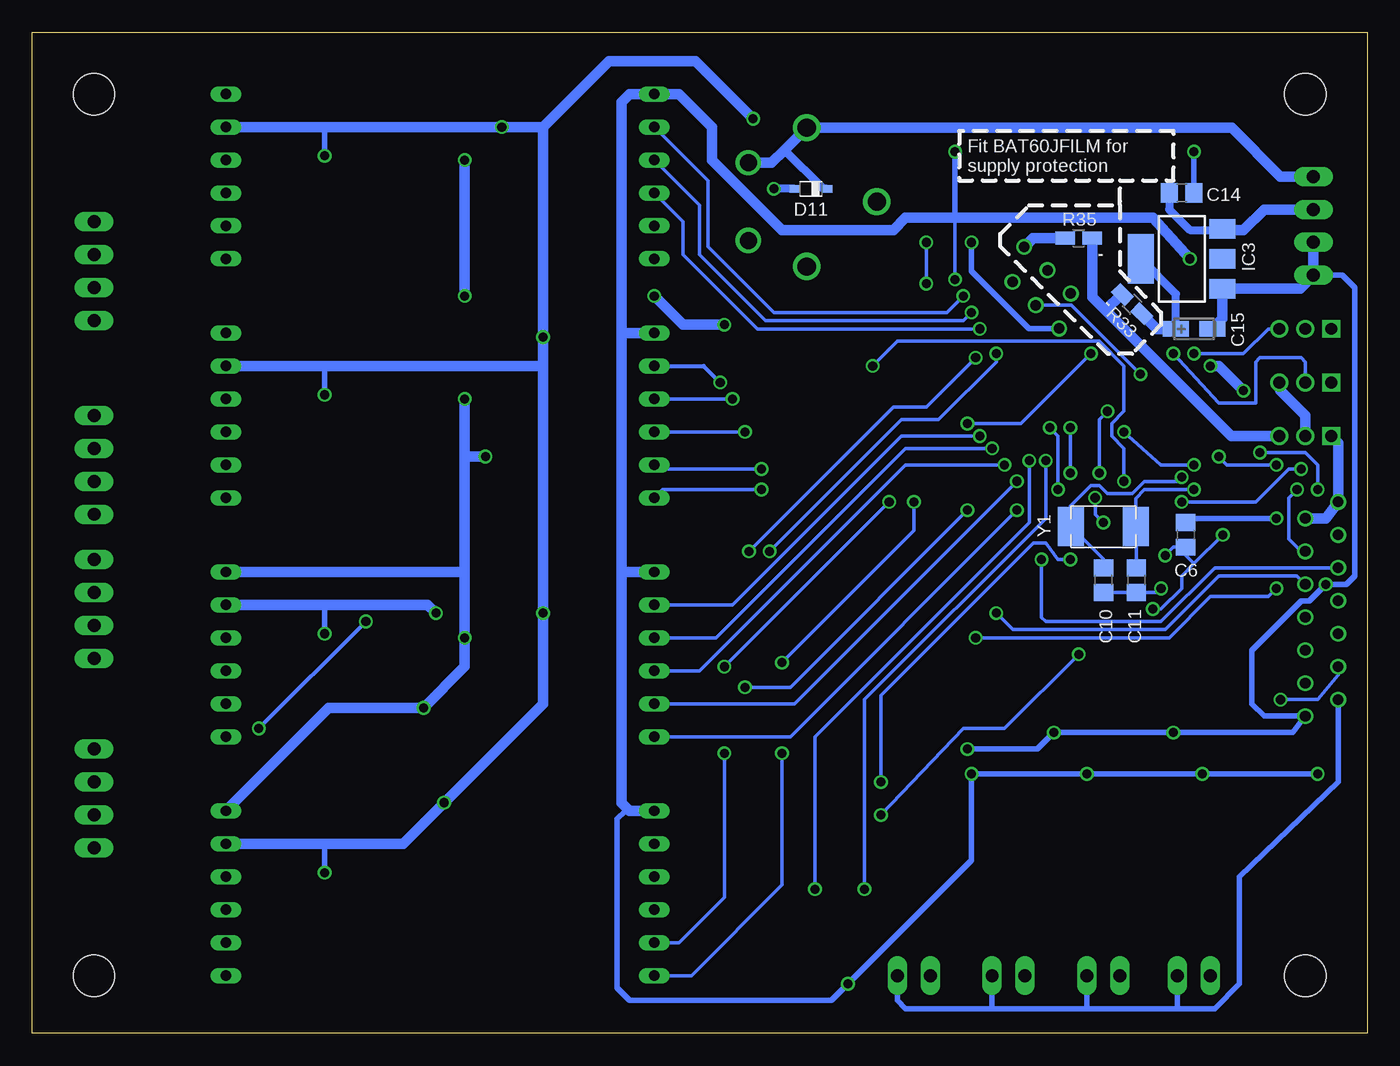
[diagram p7: board, bottom side, seen from below]

Size 102.85 x 77.14 mm. Coordinates in mm from the lower left corner, seen from the top.
Outline: 0,0 102.85,0 102.85,77.14 0,77.14 0,0
Copper layers (1*16): Top 0.0356mm / dielectric 1.5011mm / Bottom 0.0356mm
Design rules "LaenPCBOrder": minimum track width 6mil, minimum drill 13mil, track to track 6mil, track to pad 6mil, pad to pad 6mil, via to via 6mil, smd to smd 6mil, copper to edge 15mil, drill to drill 6mil, minimum pad ring 7mil, minimum via ring 7mil, stop-mask expansion 3mil, vias tented up to drill 0mil, thermal gap 10mil

### Footprints (pad centres in the part's own frame; a part is rotated, then mirrored left to right if it is on the bottom)
C0805 = smd 1.3 x 1.5: 1 -0.95,0; 2 0.95,0
C1206 = smd 1.6 x 1.8: 1 -1.4,0; 2 1.4,0
CT3216 = smd 2 x 1.2: + -1.4,0; - 1.4,0
CAPAE660X800N = smd 3.251 x 0.762: 1 -2.413,0; 2 2.413,0
SOD123 = smd 1.4 x 1.4: A 1.9,0; C -1.9,0
CHIP-LED0805 = smd 1.2 x 1.2: A 0,-1.05; C 0,1.05
SOD323_ST = smd 0.8 x 0.6: A 1.25,0; C -1.25,0
3,2 = hole 3.2: 0,0
SO14 = smd 0.66 x 2.032: 1 -3.81,-3.073; 2 -2.54,-3.073; 3 -1.27,-3.073; 4 0,-3.073; 5 1.27,-3.073; 6 2.54,-3.073; 7 3.81,-3.073; 8 3.81,3.073; 9 2.54,3.073; 10 1.27,3.073; 11 0,3.073; 12 -1.27,3.073; 13 -2.54,3.073; 14 -3.81,3.073
LQFP100 = smd 0.3 x 1.2: 1 -6,-7.75; 2 -5.5,-7.75; 3 -5,-7.75; 4 -4.5,-7.75; 5 -4,-7.75; 6 -3.5,-7.75; 7 -3,-7.75; 8 -2.5,-7.75; 9 -2,-7.75; 10 -1.5,-7.75; 11 -1,-7.75; 12 -0.5,-7.75; 13 0,-7.75; 14 0.5,-7.75; 15 1,-7.75; 16 1.5,-7.75; 17 2,-7.75; 18 2.5,-7.75; 19 3,-7.75; 20 3.5,-7.75; 21 4,-7.75; 22 4.5,-7.75; 23 5,-7.75; 24 5.5,-7.75; 25 6,-7.75; 51 6,7.75; 52 5.5,7.75; 53 5,7.75; 54 4.5,7.75; 55 4,7.75; 56 3.5,7.75; 57 3,7.75; 58 2.5,7.75; 59 2,7.75; 60 1.5,7.75; 61 1,7.75; 62 0.5,7.75; 63 0,7.75; 64 -0.5,7.75; 65 -1,7.75; 66 -1.5,7.75; 67 -2,7.75; 68 -2.5,7.75; 69 -3,7.75; 70 -3.5,7.75; 71 -4,7.75; 72 -4.5,7.75; 73 -5,7.75; 74 -5.5,7.75; 75 -6,7.75 | smd 1.2 x 0.3: 26 7.75,-6; 27 7.75,-5.5; 28 7.75,-5; 29 7.75,-4.5; 30 7.75,-4; 31 7.75,-3.5; 32 7.75,-3; 33 7.75,-2.5; 34 7.75,-2; 35 7.75,-1.5; 36 7.75,-1; 37 7.75,-0.5; 38 7.75,0; 39 7.75,0.5; 40 7.75,1; 41 7.75,1.5; 42 7.75,2; 43 7.75,2.5; 44 7.75,3; 45 7.75,3.5; 46 7.75,4; 47 7.75,4.5; 48 7.75,5; 49 7.75,5.5; 50 7.75,6; 76 -7.75,6; 77 -7.75,5.5; 78 -7.75,5; 79 -7.75,4.5; 80 -7.75,4; 81 -7.75,3.5; 82 -7.75,3; 83 -7.75,2.5; 84 -7.75,2; 85 -7.75,1.5; 86 -7.75,1; 87 -7.75,0.5; 88 -7.75,0; 89 -7.75,-0.5; 90 -7.75,-1; 91 -7.75,-1.5; 92 -7.75,-2; 93 -7.75,-2.5; 94 -7.75,-3; 95 -7.75,-3.5; 96 -7.75,-4; 97 -7.75,-4.5; 98 -7.75,-5; 99 -7.75,-5.5; 100 -7.75,-6
SOT223 = smd 1.5 x 2: 1 -2.3,-3.15; 2 0,-3.15; 3 2.3,-3.15 | smd 3.8 x 2: 4 0,3.15
1X03M = drill 0.914 square: 1 -2,0 | drill 0.914: 2 0,0; 3 2,0
CP1 = drill 1.3: 1 2.65,-4.5; 2 -3.35,-4.5 | drill 1.4: C 5.35,0; NC -0.35,5.4; NO -5.35,0
22-23-2041 = drill 1 long: 1 -3.81,0; 2 -1.27,0; 3 1.27,0; 4 3.81,0
SUPER-SOT3 = smd 1 x 1.4: 1 -0.95,-1.1; 2 0.95,-1.1; 3 0,1.1
M0805 = smd 1.3 x 1.6: 1 -0.95,0; 2 0.95,0
R0805W = smd 1.5 x 1: 1 -1.052,0; 2 1.052,0
MICROMATCH-14 = drill 0.813: 1 8.255,1.27; 2 6.985,-1.27; 3 5.715,1.27; 4 4.445,-1.27; 5 3.175,1.27; 6 1.905,-1.27; 7 0.635,1.27; 8 -0.635,-1.27; 9 -1.905,1.27; 10 -3.175,-1.27; 11 -4.445,1.27; 12 -5.715,-1.27; 13 -6.985,1.27; 14 -8.255,-1.27
REPICO_STEPPER = drill 0.8 long: DIR 0,0; DIS 0,5.08; GND 33.02,10.16; MS1 0,10.16; MS2 0,7.62; OUT1A 33.02,2.54; OUT1B 33.02,0; OUT2A 33.02,5.08; OUT2B 33.02,7.62; STEP 0,2.54; VCC 33.02,12.7; VDD 0,12.7
MICROMATCH-6 = drill 0.813: 1 3.175,1.27; 2 1.905,-1.27; 3 0.635,1.27; 4 -0.635,-1.27; 5 -1.905,1.27; 6 -3.175,-1.27
SOT23 = smd 1 x 1.4: 1 -0.95,-1.1; 2 0.95,-1.1; 3 0,1.1
22-23-2021 = drill 1 long: 1 -1.27,0; 2 1.27,0
CRYSTAL-SMD-5X3.2 = smd 2 x 3: P$1 -2.5,0; P$2 2.5,0

### Placement (x,y rotation side)
C1  34.92,20.95 180 top
C2  26.04,20.95 180 top
C3  17.14,20.95 180 top
C4  8.26,20.95 180 top
C5  34.29,34.29 0 top
C6  13.97,38.42 90 bottom
C7  19.37,29.84 270 top
C8  13.97,47.31 270 top
C9  34.29,50.8 0 top
C10  20.32,34.92 90 bottom
C11  17.78,34.92 90 bottom
C12  33.34,53.98 0 top
C13  34.29,31.11 0 top
C14  14.29,64.77 0 bottom
C15  13.34,54.29 0 bottom
C16  63.5,64.77 90 top
C17  63.5,46.35 90 top
C18  63.5,26.99 90 top
C19  63.5,13.02 270 top
D1  33.02,16.51 270 top
D2  24.13,16.51 270 top
D3  15.24,16.51 270 top
D4  6.35,16.51 270 top
D5  100.33,66.36 180 top
D6  100.33,51.44 180 top
D7  100.33,25.4 180 top
D8  100.33,10.48 180 top
D9  46.35,73.98 180 top
D10  40.64,73.98 180 top
D11  42.86,65.09 180 bottom
H1  4.76,72.39 0 top
H2  98.11,72.39 0 top
H3  4.76,4.45 0 top
H4  98.11,4.45 0 top
IC1  42.55,11.43 180 top
IC2  24.77,42.55 270 top
IC3  14.29,59.69 90 bottom
JP1  4.76,54.29 0 top
JP2  4.76,50.16 0 top
JP3  4.76,46.04 0 top
K1  43.18,64.45 90 top
MOTOR_A  98.11,58.74 90 top
MOTOR_B  98.11,43.81 90 top
MOTOR_D  98.11,18.1 90 top
MOTOR_G  98.11,32.7 90 top
PWR  4.13,62.23 270 top
Q1  13.34,56.52 0 top
R1  44.77,54.29 90 top
R2  30.48,16.51 90 top
R3  35.56,16.51 90 top
R4  21.59,16.51 90 top
R5  26.67,16.51 90 top
R6  12.7,16.51 90 top
R7  17.78,16.51 90 top
R8  3.81,16.51 90 top
R9  8.89,16.51 90 top
R10  47.62,54.29 90 top
R11  79.38,70.48 180 top
R12  74.3,67.31 0 top
R13  74.3,70.48 180 top
R14  74.3,64.77 180 top
R15  74.3,52.07 180 top
R16  79.38,52.07 180 top
R17  74.3,48.9 0 top
R18  74.3,46.35 180 top
R19  74.3,33.66 180 top
R20  79.38,33.66 180 top
R21  74.3,30.48 0 top
R22  74.3,27.94 180 top
R23  74.3,15.24 180 top
R24  79.38,15.24 180 top
R25  74.3,12.06 0 top
R26  74.3,9.53 180 top
R27  38.1,54.29 270 top
R28  25.4,29.84 90 top
R29  10.48,41.59 90 top
R30  17.78,56.2 270 top
R31  19.68,60.64 0 top
R32  11.11,60.01 270 top
R33  18.1,56.2 135 bottom
R34  36.2,73.98 270 top
R35  22.23,61.28 0 bottom
R36  15.88,64.14 0 top
RAP  3.49,32.7 90 top
STEPPER_A  54.93,59.69 0 top
STEPPER_B  54.93,41.27 0 top
STEPPER_D  54.93,4.45 0 top
STEPPER_G  54.93,22.86 0 top
SWD  25.08,57.47 45 top
T1  41.27,54.29 180 top
T2  83.19,67.31 270 top
T3  78.74,66.04 0 top
T4  83.19,48.9 270 top
T5  78.74,47.62 0 top
T6  83.19,30.48 270 top
T7  78.74,29.21 0 top
T8  83.19,12.06 270 top
T9  78.74,10.79 0 top
T10  15.88,59.37 180 top
X1  34.92,4.45 0 top
X2  27.62,4.45 0 top
X3  20.32,4.45 0 top
X4  13.34,4.45 0 top
Y1  20.32,39.05 180 bottom

### Tracks (layer width: path | path; a pad name or v marks a point on that pad's centre or on a via)
3_3V  (via drill 0.7)
  Top 0.254: v20,47.94 18.73,49.21 18.73,49.85 | 18.73,50.16 18.73,50.26 | 18.73,50.16 18.73,49.85 | 18.73,49.85 16.51,49.85 14.92,48.26 C8.1 13.34,48.26 11.11,46.04 | R29.2 10.48,45.4 | v11.11,38.42 8.57,38.42 | v15.56,36.83 15.56,38.73 16.37,39.55 IC2.19 | v30.16,30.48 30.77,31.08 IC2.50 32.84,34.8 | v6.99,34.29 6.99,36.51 8.57,38.1 | C9.1 33.34,56.51 v31.75,58.1 | 19.68,43.18 19.68,40.64 20,40.32 20.64,40.32 21.27,39.69 21.27,39.05 20.64,38.42 18.73,38.42 18.61,38.55 IC2.21 IC2.22 17.07,38.1 17.14,38.1 | 19.68,43.18 19.68,43.5 19.64,43.55 IC2.11 | v20.64,43.18 19.68,43.18 | 19.77,30.56 19.68,30.48 | 19.68,30.48 17.14,30.48 16.51,31.11 v16.51,32.7 | IC2.28 19.77,31.19 C7.1 19.68,30.48 | IC2.100 18.77,50.2 18.73,50.16
  Top 0.305: C9.1 32.52,49.98 IC2.75 | 32.84,34.8 C5.1
  Top 0.406: 42.55,12.7 40.01,12.7 IC1.9 v40.01,3.81 | 43.81,12.7 IC1.12 43.81,6.99 44.45,6.35 45.72,6.35 46.35,6.99 IC1.14 | IC1.4 42.55,12.7 | IC1.1 46.35,13.34 45.72,12.7 43.81,12.7 | 43.81,12.7 42.55,12.7 | R8.2 v3.81,20 | v30.48,20 R2.2 | R4.2 v21.59,20 | v31.75,67.94 31.75,68.58 R34.2 | R6.2 v12.7,20
  Top 0.813: 8.57,38.1 8.57,38.42 8.57,43.18 10.48,45.4 11.11,46.04 11.11,50.16 10.48,50.8 10.48,58.42 R32.2 13.33,59.06 13.34,59.05 | Q1.3 13.34,59.05 | 13.34,59.05 13.34,59.37 v13.65,59.69
  Bottom 0.254: v20.64,43.18 20.64,47.31 v20,47.94 | 13.34,36.2 v11.11,38.42 | 13.65,37.78 C6.1 | 13.65,37.47 C6.1 | C6.1 14.92,37.47 v15.56,36.83 | C6.1 13.97,36.83 13.34,36.2 | v30.16,30.48 15.24,30.48 12.06,33.66 7.62,33.66 v6.99,34.29 | v31.75,58.1 31.75,62.87 | v16.51,32.7 15.88,32.7 14.29,34.29 14.29,35.24 13.34,36.2
  Bottom 0.406: STEPPER_D.VDD 57.15,17.14 57.78,16.51 57.78,3.49 56.83,2.54 41.27,2.54 v40.01,3.81 30.48,13.34 v30.48,20 v21.59,20 v12.7,20 v3.81,20 | v31.75,67.94 31.75,62.87
  Bottom 0.813: STEPPER_D.VDD 56.83,17.14 57.47,17.78 57.47,35.56 | 57.47,35.56 57.47,53.98 | 57.47,53.98 57.47,71.75 56.83,72.39 STEPPER_A.VDD 53.02,72.39 50.48,69.85 50.48,67.31 45.09,61.91 36.51,61.91 35.56,62.87 31.75,62.87 16.51,62.87 v13.65,59.69 | STEPPER_B.VDD 57.47,53.98 | STEPPER_G.VDD 57.47,35.56
3_3V_ENBL  (via drill 0.7)
  Top 0.254: v14.92,52.39 15.56,53.02 18.41,53.02 20,54.61 20,57.15 20.64,57.78 20.64,59.37 R31.2
  Bottom 0.254: v14.92,52.39 11.43,48.58 8.57,48.58 8.57,51.75 8.26,52.07 5.08,52.07 4.76,51.75 JP2.2
12V  (via drill 0.7)
  Top 0.406: R13.2 R12.1 v69.53,67.31 | R15.2 R17.1 v69.53,48.9 | R19.2 R21.1 v69.53,30.48 | R25.1 R23.2 72.71,15.87 v72.71,25.08 | K1.NO 44.72,59.1 44.77,59.05
  Top 0.813: R10.2 47.62,56.2 | 43.18,59.05 44.77,59.05 47.62,56.2 | 47.62,56.2 49.21,56.2 49.53,55.88 v49.53,54.61 | v54.93,56.83 v69.53,56.83 | v69.53,56.83 85.72,56.83 87.95,54.61 STEPPER_B.VCC | STEPPER_A.VCC 87.95,72.71 87,73.66 72.07,73.66 69.53,71.12 v69.53,67.31 | v69.53,56.83 v69.53,48.9 | C17.1 67.44,43.94 v67.94,44.45 | C18.1 C19.1 63.5,15.88 v72.71,25.08 | C16.1 64.01,62.36 v69.53,56.83
  Bottom 0.813: v49.53,54.61 52.7,54.61 v54.93,56.83 | v69.53,67.31 v69.53,56.83 | v69.53,48.9 69.53,44.45 | 69.53,44.45 69.53,35.56 | 69.53,35.56 v69.53,30.48 69.53,28.26 v72.71,25.08 80.01,25.08 STEPPER_D.VCC | STEPPER_G.VCC 69.53,35.56 | v67.94,44.45 69.53,44.45
12V_ENBL  (via drill 0.7)
  Top 0.254: IC2.15 18.05,41.55 18.73,42.23 v18.73,42.55 | R27.2 v38.1,51.44 41.91,51.44 43.82,53.34 R1.1
  Bottom 0.254: v38.1,51.44 36.2,53.34 20.64,53.34 18.73,51.44 18.73,47.94 19.68,46.99 19.68,46.04 18.73,45.09 v18.73,42.55
A_DIR
  Top 0.254: IC2.55 51.88,38.55 51.88,56.52 STEPPER_A.DIR
A_DIS  (via drill 0.7)
  Top 0.254: v29.84,54.29 28.57,54.29 25.77,51.48 IC2.86
  Top 0.305: R14.2 STEPPER_A.DIS
  Bottom 0.254: STEPPER_A.DIS 52.7,62.55 52.7,60.01 46.99,54.29 v29.84,54.29
A_ENDST  (via drill 0.7)
  Top 0.254: IC1.6 40.01,15.88 39.05,16.83 v37.47,16.83 | IC2.33 22.27,29.25 v22.23,29.21
  Bottom 0.254: v37.47,16.83 31.11,23.5 27.94,23.5 v22.23,29.21
A_ENDSW
  Top 0.305: X1.1 33.02,5.08 D1.A
  Top 0.406: R2.1 32.07,15.56 D1.A 33.97,15.56 R3.1
A_MS1  (via drill 0.7)
  Top 0.254: v31.11,56.83 28.57,56.83 24.77,53.02 IC2.88
  Bottom 0.254: STEPPER_A.MS1 50.8,65.72 50.8,60.64 45.72,55.56 32.38,55.56 v31.11,56.83
A_MS2  (via drill 0.7)
  Top 0.254: v30.48,55.56 28.57,55.56 25.27,52.25 IC2.87
  Bottom 0.254: STEPPER_A.MS2 51.44,63.82 51.44,60.01 46.35,54.93 31.11,54.93 v30.48,55.56
A_OUT1A
  Top 0.813: MOTOR_A.2 STEPPER_A.OUT1A
A_OUT1B
  Top 0.813: MOTOR_A.1 STEPPER_A.OUT1B
A_OUT2A
  Top 0.813: MOTOR_A.3 STEPPER_A.OUT2A
A_OUT2B
  Top 0.813: MOTOR_A.4 STEPPER_A.OUT2B
A_STEP
  Top 0.254: IC2.56 51.43,39.05 51.44,58.42 STEPPER_A.STEP
B_DIR  (via drill 0.7)
  Top 0.254: IC2.64 37.28,43.05 39.05,41.27 46.04,41.27 v46.67,41.91
  Bottom 0.254: v46.67,41.91 54.29,41.91 STEPPER_B.DIR
B_DIS  (via drill 0.7)
  Top 0.254: v47.94,46.35 47.94,40.64 38.73,40.64 36.83,42.55 IC2.63
  Top 0.305: STEPPER_B.DIS R18.2
  Bottom 0.254: STEPPER_B.DIS v47.94,46.35
B_ENDST  (via drill 0.7)
  Top 0.254: IC1.3 43.81,15.88 40.32,19.37 v37.47,19.37 | IC2.34 22.77,36.42 v22.86,36.51
  Bottom 0.254: v37.47,19.37 37.47,26.04 25.72,37.78 24.77,37.78 23.81,36.51 v22.86,36.51
B_ENDSW
  Top 0.305: X2.1 24.13,6.67 D2.A
  Top 0.406: R4.1 23.18,15.56 D2.A 25.08,15.56 R5.1
B_MS1  (via drill 0.7)
  Top 0.254: IC2.57 49.85,39.55 v49.85,50.16
  Bottom 0.305: STEPPER_B.MS1 51.12,51.44 v49.85,50.16
B_MS2  (via drill 0.7)
  Top 0.254: v48.9,48.9 48.9,40.01 32.55,40.01
  Top 0.305: 32.55,40.01 IC2.58
  Bottom 0.254: STEPPER_B.MS2 v48.9,48.9
B_OUT1A
  Top 0.813: MOTOR_B.2 STEPPER_B.OUT1A
B_OUT1B
  Top 0.813: MOTOR_B.1 STEPPER_B.OUT1B
B_OUT2A
  Top 0.813: STEPPER_B.OUT2A MOTOR_B.3
B_OUT2B
  Top 0.813: STEPPER_B.OUT2B MOTOR_B.4
B_STEP  (via drill 0.7)
  Top 0.254: IC2.65 32.56,43.5 v46.67,43.5
  Bottom 0.254: STEPPER_B.STEP 54.61,43.5 v46.67,43.5
BOOT1
  Top 0.254: IC2.37 24.27,33.2 25.4,32.07 R28.2
D_DIR  (via drill 0.7)
  Top 0.254: v45.09,28.57 v45.09,21.59 | v34.92,40.96 34.84,41.05 IC2.60
  Bottom 0.254: v45.09,28.57 34.92,38.73 v34.92,40.96 | v45.09,21.59 45.09,11.43 52.07,4.45 STEPPER_D.DIR
D_DIS  (via drill 0.7)
  Top 0.254: STEPPER_D.DIS 49.53,14.92 49.53,19.68 47.94,21.27 v47.94,26.67 | IC2.59 31.02,40.55 v30.8,40.32
  Top 0.305: R26.2 68.26,9.53 66.99,8.26 60.01,8.26 58.74,9.53 STEPPER_D.DIS
  Bottom 0.254: v30.8,40.32 44.45,26.67 v47.94,26.67
D_ENDST  (via drill 0.7)
  Top 0.254: IC1.8 v38.73,11.11 | IC2.8 23.85,45.05 v24.77,44.13
  Bottom 0.254: v38.73,11.11 38.73,25.72 24.77,39.69 v24.77,44.13
D_ENDSW
  Top 0.305: X4.1 8.89,7.62 R9.1
  Top 0.406: R8.1 5.4,15.56 D4.A 7.3,15.56 R9.1
D_MS1  (via drill 0.7)
  Top 0.254: STEPPER_D.MS1 51.75,17.78 51.75,33.02 v47.62,37.15 | v30.16,52.07 29.53,51.44 27.94,51.44 27.77,51.26 IC2.82
  Bottom 0.254: v47.62,37.15 36.51,48.26 33.97,48.26 v30.16,52.07
D_MS2  (via drill 0.7)
  Top 0.254: STEPPER_D.MS2 51.12,15.88 51.12,32.07 v46.04,37.15 | 27.3,50.26 IC2.83 27.27,51.71 27.94,52.39 v28.57,52.39
  Bottom 0.254: v46.04,37.15 35.88,47.31 33.02,47.31 28.57,51.75 v28.57,52.39
D_OUT1A
  Top 0.813: MOTOR_D.2 97.16,16.83 93.98,13.65 93.98,11.43 89.53,6.99 STEPPER_D.OUT1A
D_OUT1B
  Top 0.813: STEPPER_D.OUT1B 89.85,4.45 98.11,12.7 MOTOR_D.1
D_OUT2A
  Top 0.813: MOTOR_D.3 97.16,19.37 92.39,14.61 92.39,12.06 89.85,9.53 STEPPER_D.OUT2A
D_OUT2B
  Top 0.813: MOTOR_D.4 97.47,21.91 90.81,15.24 90.81,12.7 90.17,12.06 STEPPER_D.OUT2B
D_STEP  (via drill 0.7)
  Top 0.254: IC2.61 32.56,41.59 33.66,41.59 33.97,41.91 35.88,41.91 v36.83,40.96 | v49.53,28.26 v49.53,21.59
  Bottom 0.254: v36.83,40.96 v49.53,28.26 | v49.53,21.59 49.53,10.48 53.02,6.99 STEPPER_D.STEP
EXT_3_3V
  Bottom 0.813: 20.16,55.72 21.17,56.73 R35.2 | 20.16,55.72 10.48,46.04 JP3.3 | R33.2 18.94,56.94 20.16,55.72
G_DIR  (via drill 0.7)
  Top 0.254: IC2.9 22.77,44.55 v26.99,40.32
  Bottom 0.254: v26.99,40.32 44.45,22.86 STEPPER_G.DIR
G_DIS  (via drill 0.7)
  Top 0.254: IC2.80 28.77,47.81 27.94,46.99 v27.94,43.81
  Top 0.305: R22.2 72.39,26.99 55.88,26.99 STEPPER_G.DIS
  Bottom 0.254: v27.94,43.81 35.56,43.81 51.44,27.94 STEPPER_G.DIS
G_ENDST  (via drill 0.7)
  Top 0.254: IC1.11 v42.55,11.11 | IC2.7 24.62,45.55 v26.04,44.13
  Bottom 0.254: v42.55,11.11 42.55,22.86 26.04,39.37 v26.04,44.13
G_ENDSW
  Top 0.305: X3.1 15.24,8.26 D3.A
  Top 0.406: 12.7,15.88 R6.1 14.29,15.56 D3.A 16.19,15.56 R7.1
G_MS1  (via drill 0.7)
  Top 0.254: IC2.78 29.77,46.12 v29.84,46.04
  Bottom 0.254: v29.84,46.04 35.88,46.04 48.9,33.02 STEPPER_G.MS1
G_MS2  (via drill 0.7)
  Top 0.254: IC2.79 29.27,47.36 28.89,46.99 v28.89,45.09
  Bottom 0.254: STEPPER_G.MS2 50.16,30.48 35.56,45.09 v28.89,45.09
G_OUT1A
  Top 0.813: MOTOR_G.2 STEPPER_G.OUT1A
G_OUT1B
  Top 0.813: MOTOR_G.1 STEPPER_G.OUT1B
G_OUT2A
  Top 0.813: STEPPER_G.OUT2A MOTOR_G.3
G_OUT2B
  Top 0.813: STEPPER_G.OUT2B MOTOR_G.4
G_STEP  (via drill 0.7)
  Top 0.254: IC2.81 28.27,48.27 26.99,46.99 v26.99,42.55
  Bottom 0.254: v26.99,42.55 44.13,25.4 STEPPER_G.STEP
GND  (via drill 0.7)
  Top 0.254: 14.61,46.35 C8.2 | C8.2 16.28,44.05 IC2.10 21.36,44.05 21.59,43.81 21.59,42.23 20.95,41.59 v20.95,41.27 | C8.2 13.34,46.35 v11.43,44.45 | v6.99,43.81 v6.99,39.69 | C9.2 35.24,49.21 34.08,48.05 IC2.74 | C12.2 34.74,57.02 v33.97,57.78 | 33.97,66.04 33.66,66.36 | 8.89,25.4 9.53,26.04 9.53,28.26 15.56,34.29 v15.88,34.29 16.19,33.97 17.14,33.97 17.78,33.34 18.73,33.34 19.27,33.87 IC2.27 | IC2.99 19.27,49.31 19.68,48.9 20.64,48.9 20.95,48.58 20.95,47.62 20.32,46.99 19.68,46.99 18.73,47.94 18.73,48.26 17.78,49.21 16.51,49.21 15.88,48.58 15.88,47.62 14.61,46.35 | IC2.20 20,39.05 v20.32,39.37 | 14.61,46.35 14.61,45.72 16.19,44.13 | T10.2 R36.1 14.93,66.36 14.92,66.36 | R32.1 9.05,63.02
  Top 0.305: 35.24,31.57 C13.2 35.56,31.11 | C9.2 35.24,53.47 C12.2 | 38.25,55.39 R27.1
  Top 0.406: T3.2 80.67,64.94 | 80.67,64.94 T2.2 | T5.2 80.67,46.52 | 80.67,46.52 T4.2 | T7.2 80.67,28.11 | 80.67,28.11 T6.2 | T9.2 80.67,9.7 | 80.67,9.7 T8.2 | 80.67,64.94 80.67,67.29 v80.33,67.63 | 80.67,46.52 80.67,48.88 v80.33,49.21 | 80.67,28.11 80.67,30.46 v80.33,30.8 | v80.33,12.38 80.67,12.04 80.67,9.7 | D10.C D9.C 46.35,71.44 v47.31,70.48 | v13.34,67.94 13.34,66.36 | RAP.13 3.17,24.45 RAP.14 | RAP.14 7.25,21.64 C4.2 | C3.2 16.14,21.95 v14.92,23.18 | C2.2 25.04,22.27 v24.13,23.18 | C1.2 31.75,20.95 v30.8,21.91 | R28.1 25.4,27.3 | C7.2 19.37,27.3 | 25.4,27.3 19.37,27.3 | 19.37,27.3 10.79,27.3 8.89,25.4 7.94,24.45 RAP.14 | IC1.7 37.68,14.5 37.15,13.97 37.15,5.4 X1.2 | C5.2 35.24,31.57 | 35.56,31.11 35.56,29.84 33.02,27.3 25.4,27.3 | v3.17,34.61 4.45,35.88 5.08,35.88 6.99,37.78 v6.99,39.69 | 30.48,66.36 v30.48,60.96 | 33.97,66.04 v33.97,60.96 38.1,56.83 R27.1 | T1.2 38.25,55.39
  Top 0.813: v71.75,32.38 v63.5,32.38 C18.2 | C17.2 v63.5,53.66 | C16.2 64.01,67.18 v66.67,69.85 | PWR.3 6.99,60.96 | 6.99,60.96 9.05,63.02 12.38,66.36 13.34,66.36 14.92,66.36 30.48,66.36 33.66,66.36 43.18,66.36 v47.31,70.48 | 6.99,60.96 | v71.12,17.78 63.94,10.6 C19.2
  Bottom 0.254: C11.1 C10.1 C11.1 16.19,33.97 v15.88,34.29 | v11.43,44.45 10.79,43.81 v6.99,43.81 | v33.97,57.78 v33.97,60.96 | v20.32,39.37 20.95,40.01 v20.95,41.27
  Bottom 0.406: v80.33,67.63 80.33,69.85 | v80.33,49.21 80.33,51.12 80.64,51.44 | v80.33,30.8 80.33,33.02 | 80.33,14.61 v80.33,12.38 | X4.2 14.61,1.91 | 21.59,1.91 28.89,1.91 | 28.89,1.91 35.56,1.91 36.2,2.54 X1.2 | 28.89,1.91 X2.2 | 14.61,1.91 21.59,1.91 | 21.59,1.91 X3.2 | C14.2 v13.34,67.94 | v30.8,21.91 25.4,21.91 v24.13,23.18 v14.92,23.18 5.71,23.18 RAP.14 7.94,24.45 8.89,25.4 8.89,29.53 5.08,33.34 4.45,33.34 v3.17,34.61 1.59,34.61 0.95,35.24 0.95,57.47 1.91,58.42 PWR.4 | 14.61,1.91 11.75,1.91 9.84,3.81 9.84,12.06 2.22,19.37 RAP.13 | 13.34,39.69 13.65,39.69 C6.2 13.65,39.37 13.34,39.69 | 13.34,39.69 v6.99,39.69 | SWD.6 26.07,54.32 30.48,58.74 v30.48,60.96
  Bottom 0.813: STEPPER_D.GND 80.33,14.61 74.3,14.61 v71.12,17.78 63.5,25.4 v63.5,32.38 63.5,51.44 | STEPPER_G.GND 80.33,33.02 72.39,33.02 v71.75,32.38 | STEPPER_B.GND 80.64,51.44 63.5,51.44 | STEPPER_A.GND 80.33,69.85 v66.67,69.85 63.5,69.85 | 63.5,51.44 v63.5,53.66 63.5,69.85 | PWR.3 PWR.4 5.16,57.39 IC3.1 11.14,55.09 C15.- | v47.31,70.48 51.75,74.93 58.42,74.93 63.5,69.85
N$1
  Top 0.254: Q1.1 12.38,55.56 13.34,56.52 15.24,56.52 15.88,57.15 | 15.88,57.15 T10.3 | R30.1 16.2,57.15 15.88,57.15
N$2
  Bottom 0.813: 25.76,61.28 SWD.1 26.38,60.61 25.72,61.28 R35.1
N$3
  Top 0.254: R36.2 T10.1 18.57,60.47 R31.1
N$5
  Top 0.406: D10.A 36.3,75.03 R34.1
N$9
  Bottom 0.61: 17.46,59.66 IC3.4 14.73,56.99 C15.+
  Bottom 0.813: C15.+ 16.19,54.29 R33.1
N$17  (via drill 0.7)
  Top 0.305: K1.2 47.51,61.28 41.91,61.28 41.27,60.64 T1.3
  Top 0.61: v45.72,65.09 45.72,63.06 K1.2
  Bottom 0.61: D11.A v45.72,65.09
N$18
  Top 0.254: R1.2 42.38,55.24 T1.1
N$20
  Top 0.406: R3.2 33.97,17.46 D1.C | R3.2 35.56,20.59 C1.1 | R3.2 35.56,18.41 38.73,18.41 41.27,15.88 IC1.5
N$22
  Top 0.406: R5.2 25.08,17.46 D2.C | R5.2 26.67,20.59 C2.1 | R5.2 28.25,17.46 28.57,17.78 28.57,22.23 29.21,22.86 39.05,22.86 45.09,16.83 IC1.2
N$24
  Top 0.406: R7.2 16.19,17.46 D3.C | R7.2 17.78,20.59 C3.1 | R7.2 19.36,17.46 19.68,17.78 19.68,22.23 21.59,24.13 39.37,24.13 47.62,15.88 47.62,12.7 45.09,10.16 IC1.13
N$26
  Top 0.406: R9.2 7.3,17.46 D4.C | R9.2 8.89,20.59 C4.1 | R9.2 10.47,17.46 10.79,17.78 10.79,22.23 13.97,25.4 39.69,25.4 48.58,16.51 48.58,7.62 46.04,5.08 41.91,5.08 41.27,5.71 IC1.10
N$28
  Top 0.305: D5.C 95.35,65.31 92.08,68.58 85.56,68.58 T2.3
N$29
  Top 0.305: D5.A 94.83,67.41 91.12,71.12 83.19,71.12 82.23,72.07 75.56,72.07 75.25,71.75 R13.1
N$30
  Top 0.406: R11.1 80.33,70.02 T2.1
N$31
  Top 0.406: R12.2 78.57,67.31 T3.3 78.74,70.17 R11.2
N$32
  Top 0.305: D6.C 89.44,50.38 89.22,50.16 85.56,50.16 T4.3
N$33
  Top 0.406: R14.1 77.62,64.77 T3.1
N$34
  Top 0.305: D6.A 89.44,52.48 89.22,52.7 83.5,52.7 82.55,53.66 75.88,53.66 75.25,53.34 R15.1
N$35
  Top 0.406: R16.1 80.33,51.6 T4.1
N$36
  Top 0.406: R17.2 78.57,48.9 T5.3 78.74,51.76 R16.2
N$37
  Top 0.406: R18.1 77.62,46.35 T5.1
N$38
  Top 0.305: D7.C 95.47,24.35 91.44,20.32 86.36,20.32 84.14,22.54 84.14,30.33 T6.3
N$39  (via drill 0.7)
  Top 0.305: D7.A 96.3,26.45 91.12,21.27 87,21.27 85.41,22.86 v85.41,23.5 | v77.15,31.75 R19.1
  Bottom 0.305: v85.41,23.5 v77.15,31.75
N$40
  Top 0.406: R20.1 80.33,33.19 T6.1
N$41
  Top 0.406: R21.2 78.57,30.48 T7.3 78.74,33.34 R20.2
N$42
  Top 0.406: R22.1 77.62,27.94 T7.1
N$43
  Top 0.305: D8.C 96.42,9.43 89.53,2.54 86.36,2.54 84.45,4.45 84.45,11.89 T8.3
N$44
  Top 0.305: D8.A 100.33,22.23 99.06,23.5 96.52,23.5 92.08,19.05 77.47,19.05 75.25,16.83 R23.1
  Top 0.406: R23.1 74.93,15.24
N$45
  Top 0.406: R24.1 80.33,14.78 T8.1
N$46
  Top 0.406: R25.2 78.57,12.06 T9.3 78.74,14.93 R24.2
N$47
  Top 0.406: R26.1 77.62,9.53 T9.1
N$885
  Top 0.406: 46.35,74.61 D9.A 46.58,75.25 47.62,75.25 50.8,72.71 50.8,51.75 47.62,51.75 47.62,53.02 47.63,53.02 R10.1
NRST  (via drill 0.7)
  Top 0.254: IC2.14 15.38,42.05 v14.29,40.96 | v5.08,43.5 4.13,44.13 2.22,44.13 1.59,44.77 1.59,52.39 1.91,52.7 4.13,52.7 4.76,53.34 JP1.2
  Bottom 0.254: v14.29,40.96 8.57,40.96 6.03,43.5 v5.08,43.5
OSC_IN  (via drill 0.7)
  Top 0.254: IC2.12 14.47,43.05 v14.29,42.86
  Bottom 0.254: C10.2 20.32,36.55 Y1.P$2 22.86,39.05 22.86,40.64 21.27,42.23 20.64,42.23 20,41.59 18.1,41.59 17.14,42.55 14.61,42.55 v14.29,42.86
OSC_OUT  (via drill 0.7)
  Top 0.254: IC2.13 15.24,42.55 14.61,41.91 v13.34,41.91
  Bottom 0.254: v13.34,41.91 17.14,41.91 17.82,41.23 Y1.P$1 17.78,39.01 C11.2
RAP_3_3V
  Bottom 0.813: JP3.1 2.22,45.5 RAP.1 3.17,39.69 RAP.2
RAP_BOOTSEL  (via drill 0.7)
  Top 0.254: RAP.9 1.91,31.11 4.13,33.34 7.62,33.34 12.38,38.1 12.38,40.64 | 12.38,40.64 12.38,42.86 v13.34,43.81 | v18.73,46.35 20.95,46.35 21.77,47.16 IC2.94 | R29.1 12.38,40.64
  Bottom 0.254: v13.34,43.81 15.88,43.81 v18.73,46.35
RAP_ENBL  (via drill 0.7)
  Top 0.254: RAP.3 2.22,39.37 3.81,40.96 v3.81,41.91 | v8.26,44.77 8.26,47.62 7.62,48.26 4.67,48.26 JP2.1
  Bottom 0.254: v3.81,41.91 3.81,43.81 4.76,44.77 v8.26,44.77
RAP_INT0
  Top 0.254: IC2.16 15.96,41.05 6.03,31.11 6.03,30.8 RAP.10
RAP_INT1  (via drill 0.7)
  Top 0.254: IC2.84 26.77,48.99 v24.45,46.67 | v23.81,41.91 23.81,38.73 21.59,36.51 19.05,36.51 17.78,35.24 12.7,35.24 8.57,31.11 8.57,27.62 v6.67,25.72
  Bottom 0.254: v24.45,46.67 23.81,46.04 v23.81,41.91 | v6.67,25.72 3.81,25.72 2.22,27.62 RAP.11
RAP_INT2  (via drill 0.7)
  Top 0.254: RAP.12 6.67,26.99 7.94,28.26 7.94,31.11 12.7,35.88 17.78,35.88 19.05,37.15 21.27,37.15 22.86,38.73 v22.86,43.18 | IC2.85 26.27,49.12 25.31,49.12 v22.86,46.67
  Bottom 0.254: v22.86,43.18 v22.86,46.67
RAP_NRST  (via drill 0.7)
  Top 0.254: v5.4,41.91 3.81,43.18 1.91,43.18 0.95,44.13 0.95,53.34 1.91,54.29 JP1.1
  Bottom 0.254: v5.4,41.91 6.03,41.27 6.03,38.1 5.08,37.15 RAP.4
SPI_MISO
  Top 0.254: RAP.8 3.49,30.8 3.49,28.89 3.81,28.57 6.03,28.57 6.67,29.21 6.67,31.11 16.1,40.55 IC2.17
SPI_MOSI
  Top 0.254: RAP.7 1.59,33.34 0.95,32.7 0.95,27.62 1.59,26.99 2.86,26.99 3.81,27.94 6.35,27.94 7.3,28.89 7.3,31.11 16.19,40.01 16.98,40.01 IC2.18
SPI_NSS  (via drill 0.7)
  Top 0.254: v25.08,36.51 25.11,36.55 IC2.51
  Bottom 0.254: RAP.5 11.75,35.88 15.88,31.75 24.77,31.75 25.08,32.07 v25.08,36.51
SPI_SCK  (via drill 0.7)
  Top 0.254: 28.89,32.7 v28.57,32.38 29.27,33.08 IC2.47
  Bottom 0.254: RAP.6 5.4,35.24 11.43,35.24 15.56,31.11 27.3,31.11 v28.57,32.38
SUPPLY_3_3V  (via drill 0.7)
  Top 0.254: Q1.2 14.45,55.25 R30.2
  Top 0.813: v12.06,51.44 11.75,51.75 11.75,52.7 12.7,53.66 13.97,53.66 14.29,53.98 Q1.2 | v9.53,49.53 7.62,49.53 JP2.3
  Bottom 0.813: JP2.3 6.67,49.53 4.76,47.62 JP3.2 | v12.06,51.44 11.43,51.44 v9.53,49.53
SUPPLY_5V
  Bottom 0.61: C14.1 15.24,63.5 13.65,61.91 11.21,61.91 IC3.3
  Bottom 0.813: PWR.2 7.94,63.5 9.53,61.91 11.06,61.91 IC3.3
SUPPLY_12V
  Bottom 0.61: D11.C 41.91,65.09 44.9,68.08
  Bottom 0.813: K1.1 45.88,67.1 44.9,68.08 K1.C 10.43,69.8 6.67,66.04 PWR.1
SWCLK  (via drill 0.7)
  Top 0.254: v30.8,46.99 30.8,50.26 IC2.76 | SWD.2 25.53,57.92 25.08,57.47 24.13,57.47 23.5,58.1 22.23,58.1 21.27,57.15 v21.27,52.39
  Bottom 0.254: v21.27,52.39 26.67,46.99 v30.8,46.99
SWD_NRST  (via drill 0.7)
  Top 0.254: v17.46,50.8 14.92,50.8 v13.34,52.39
  Bottom 0.254: SWD.4 22.78,56.12 v17.46,50.8 | v13.34,52.39 9.53,52.39 7.62,54.29 JP1.3
SWDIO
  Top 0.254: SWD.3 24.84,58.81 25.08,59.05 34.29,59.05 36.51,56.83 36.51,52.39 36.83,52.07 36.83,48.26 35.62,47.05 IC2.72
SWO
  Top 0.254: IC2.89 24.27,51.3 22.54,53.02 22.54,56.72 SWD.5
VCAP_1
  Top 0.254: IC2.73 31.51,47.55 31.43,47.62 31.43,53.47 C12.1
VCAP_2
  Top 0.254: IC2.49 30.27,32.17 29.21,31.11 29.21,29.84 29.84,29.21 32.07,29.21 32.7,29.84 32.7,30.93 C13.1

### Text on the board
tPlace: NRST | SWD | 3.3V | 12V | 3_3V_ENBL | 1 | RAP | 3_3V | EXT | α | β | A. MONTI | 2016 TLS | Repico DDA | v. 1.0b | γ | δ | δ | γ | β | α
bNames: Fit BAT60JFILM for / supply protection | - | - | Y1